# EAGLE design AUVfirstdraft4 (EAGLE 9.1.2)
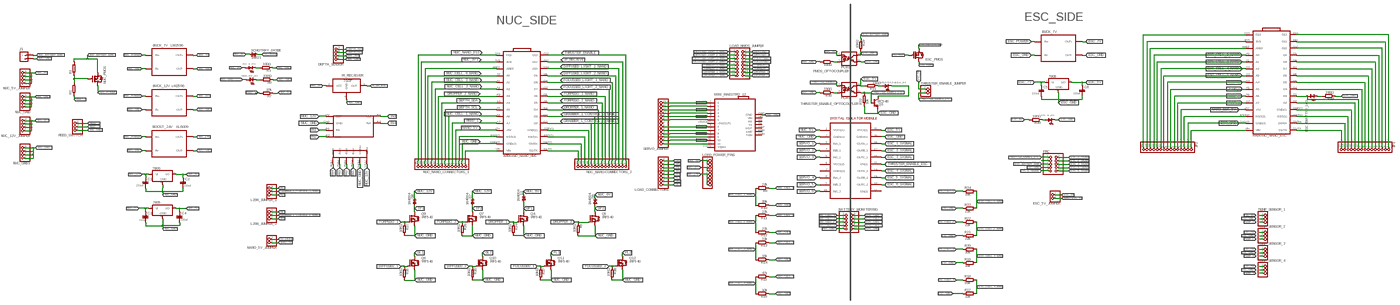
[diagram p0: schematic, sheet 1, overview]
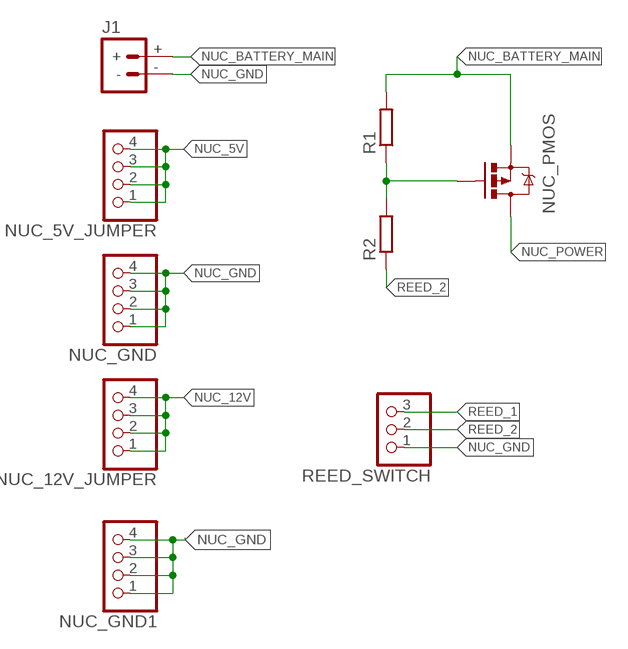
[diagram p1: schematic, sheet 1, part 1 of 4]
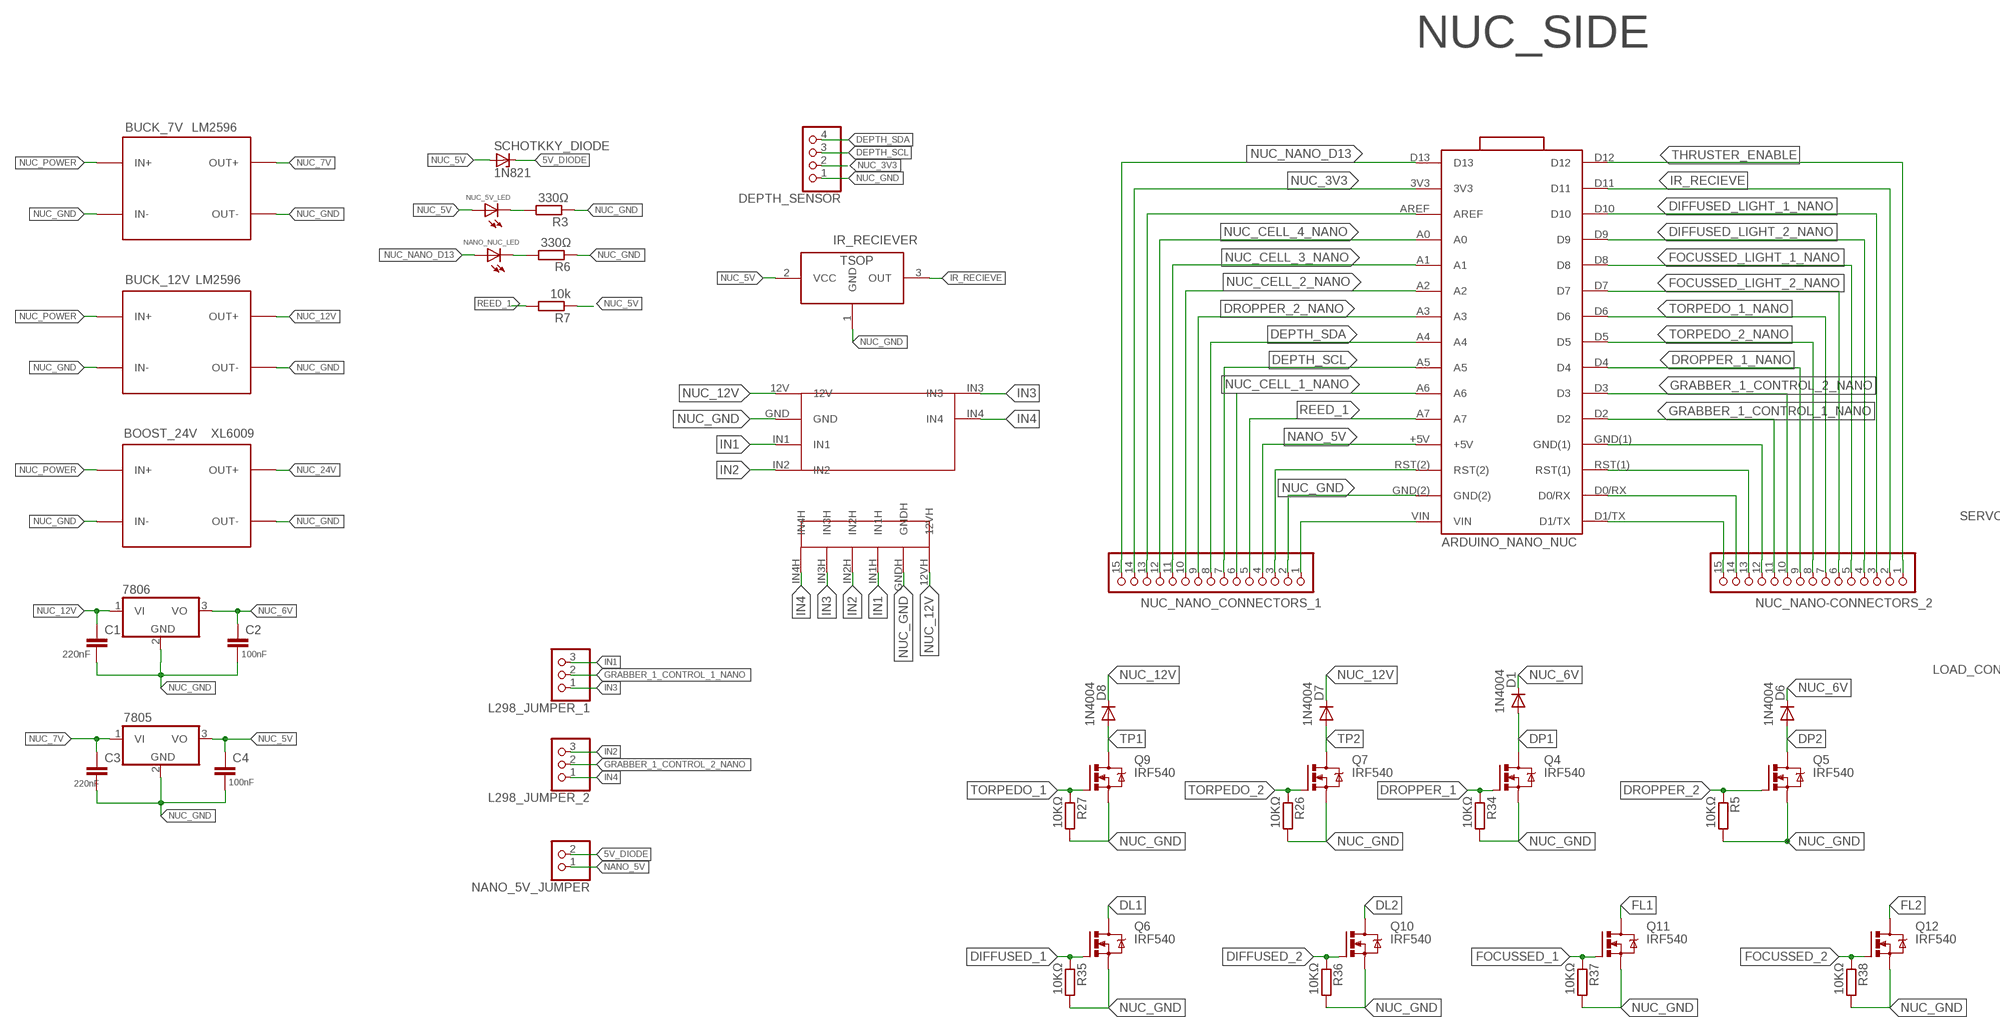
[diagram p2: schematic, sheet 1, part 2 of 4]
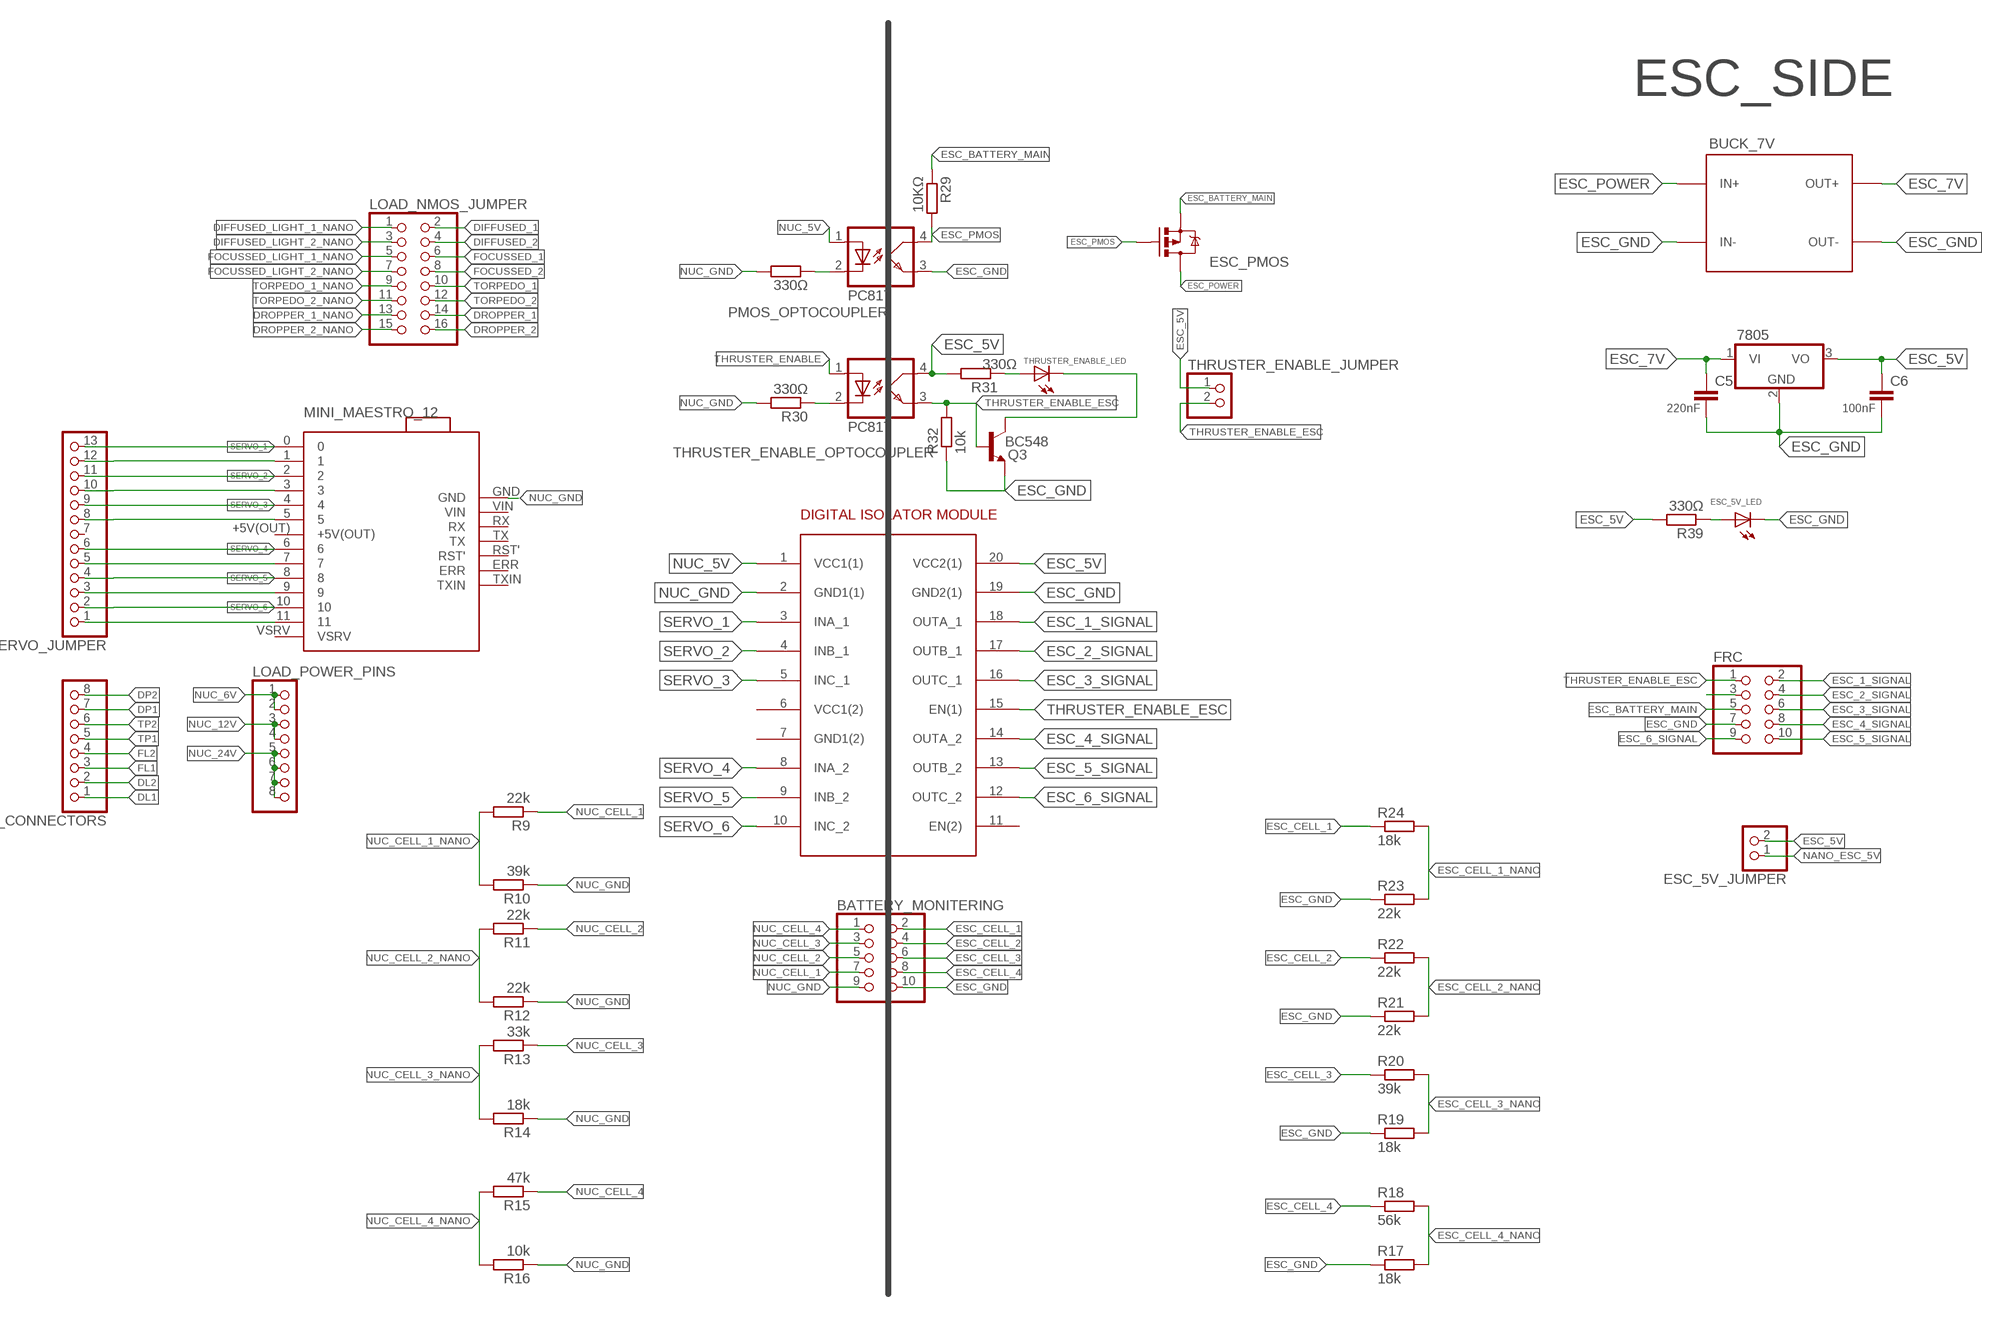
[diagram p3: schematic, sheet 1, part 3 of 4]
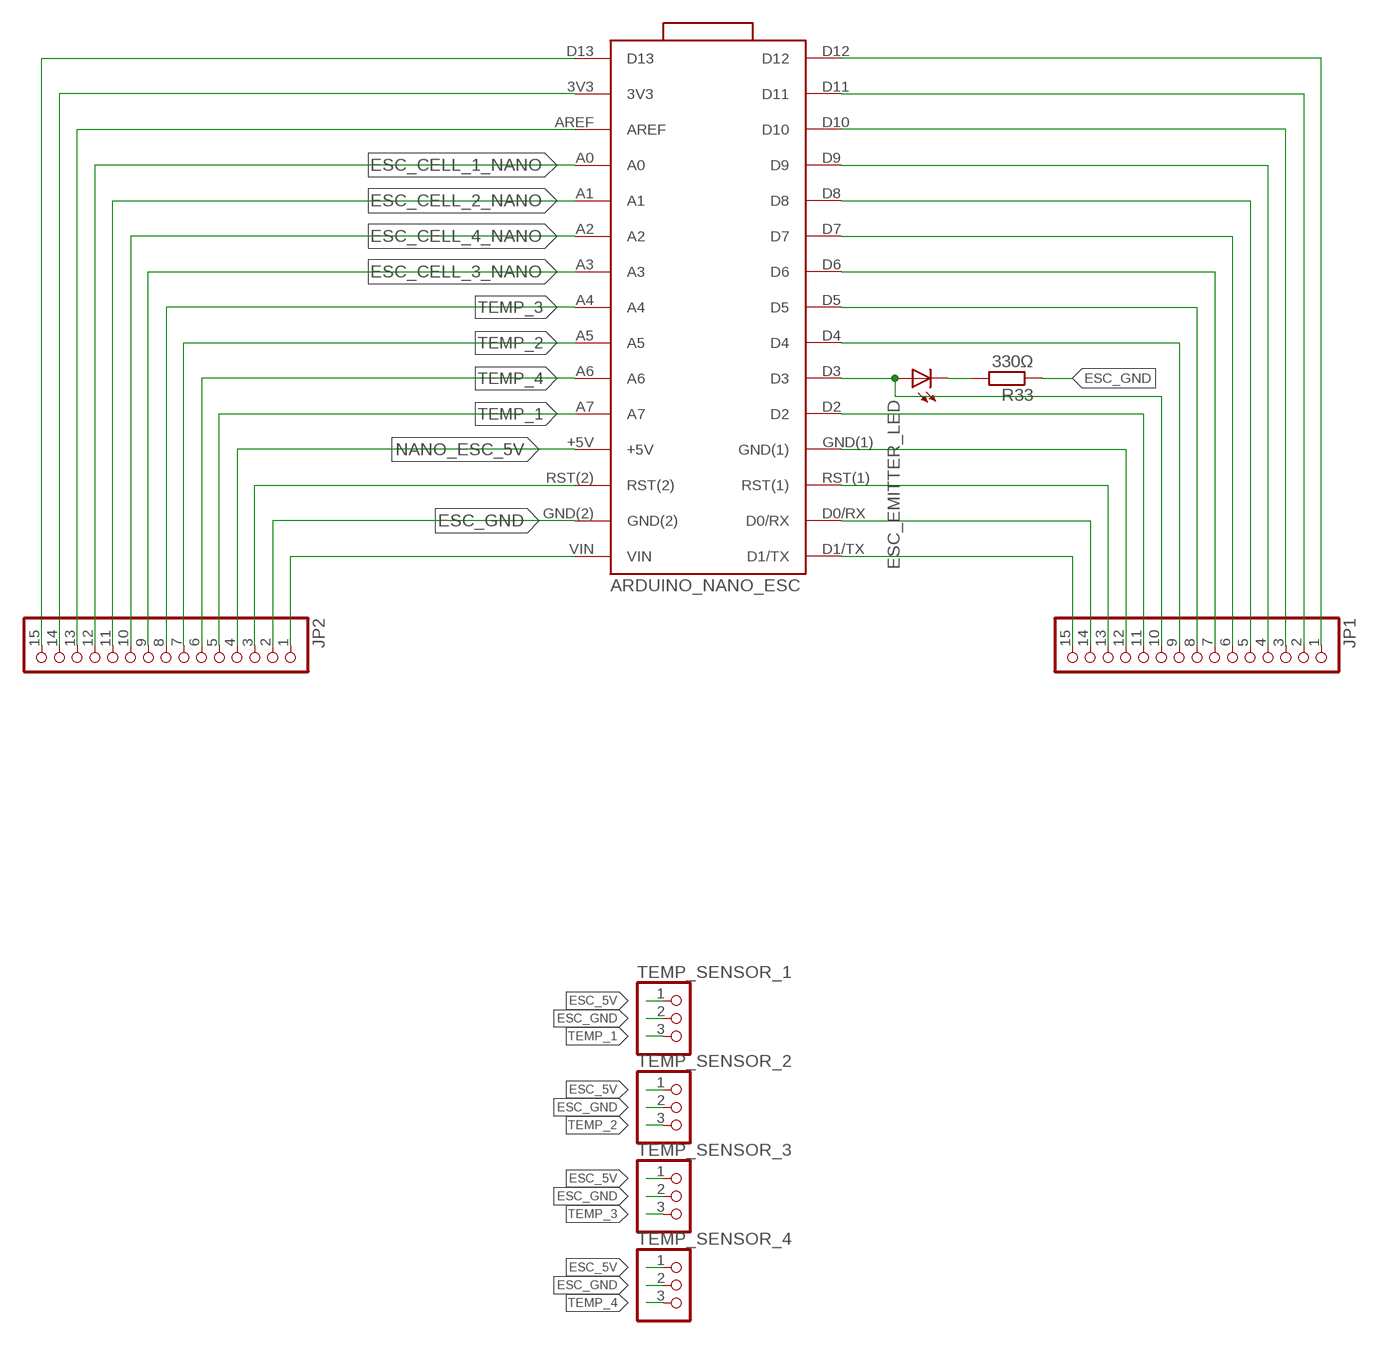
[diagram p4: schematic, sheet 1, part 4 of 4]

## Parts
330Ω  R-EU_0204/7  [0204/7]
7805_ESC  7805TV  [TO220V]
7805_NUC  7805TV  [TO220V]
7806_NUC  7805TV  [TO220V]
BATTERY_MONITERING  PINHD-2X5  [2X05]
BOOST_24V_NUC  DC-DC-STEP-DOWN-LM2596  [DC-DC-STEP-DOWN-LM2596]
BUCK_7V_ESC  DC-DC-STEP-DOWN-LM2596  [DC-DC-STEP-DOWN-LM2596]
BUCK_7V_NUC  DC-DC-STEP-DOWN-LM2596  [DC-DC-STEP-DOWN-LM2596]
BUCK_12_NUC  DC-DC-STEP-DOWN-LM2596  [DC-DC-STEP-DOWN-LM2596]
C1  220nF  C-EU025-024X044  [C025-024X044]
C2  100nF  C-EU025-024X044  [C025-024X044]
C3  220nF  C-EU025-024X044  [C025-024X044]
C4  100nF  C-EU025-024X044  [C025-024X044]
C5  220nF  C-EU025-024X044  [C025-024X044]
C6  100nF  C-EU025-024X044  [C025-024X044]
D1  1N4004  [DO41-10]
D6  1N4004  [DO41-10]
D7  1N4004  [DO41-10]
D8  1N4004  [DO41-10]
DEPTH_SENSOR  PINHD-1X4  [1X04]
ESC_5V_JUMPER  PINHD-1X2  [1X02]
ESC_5V_LED  LED3MM  [LED3MM]
ESC_EMITTER_LED  LED5MM  [LED5MM]
ESC_PMOS  MOSFET-PCHANNELFQP27P06  [TO220V]
FRC  PINHD-2X5  [2X05]
IR_RECIEVER  TSOP34X  [TSOP3XXX]
ISOLATION_CIRCUIT  DIGITAL_ISOLATOR  [DIGITAL_ISOLATOR_MODULE]
J1  BATTERY_CONN_DEANS  [DEANS]
JP1  PINHD-1X15  [1X15]
JP2  PINHD-1X15  [1X15]
L298_JUMPER_1  PINHD-1X3  [1X03]
L298_JUMPER_2  PINHD-1X3  [1X03]
L298_MOTOR_DRIVER  L298MODULE  [L298MODULE]
LOAD_CONNECTORS  PINHD-1X8  [1X08]
LOAD_NMOS_JUMPER  PINHD-2X8  [2X08]
LOAD_POWER_PINS  PINHD-1X8  [1X08]
NANO_5V_JUMPER  PINHD-1X2  [1X02]
NANO_NUC_LED  LED3MM  [LED3MM]
NUC_5V_JUMPER  PINHD-1X4  [1X04]
NUC_5V_LED  LED3MM  [LED3MM]
NUC_12V_JUMPER  PINHD-1X4  [1X04]
NUC_GND  PINHD-1X4  [1X04]
NUC_GND1  PINHD-1X4  [1X04]
NUC_NANO-CONNECTORS_2  PINHD-1X15  [1X15]
NUC_NANO_CONNECTORS_1  PINHD-1X15  [1X15]
NUC_PMOS  MOSFET-PCHANNELFQP27P06  [TO220V]
PMOS_OPTOCOUPLER  PC817  [DIL04]
Q3  BC548  [TO92-EBC]
Q4  IRF540  [TO220BV]
Q5  IRF540  [TO220BV]
Q6  IRF540  [TO220BV]
Q7  IRF540  [TO220BV]
Q9  IRF540  [TO220BV]
Q10  IRF540  [TO220BV]
Q11  IRF540  [TO220BV]
Q12  IRF540  [TO220BV]
R1  R-EU_0204/7  [0204/7]
R2  R-EU_0204/7  [0204/7]
R3  330Ω  R-EU_0204/7  [0204/7]
R5  10KΩ  R-EU_0204/7  [0204/7]
R6  330Ω  R-EU_0204/7  [0204/7]
R7  10k  R-EU_0204/7  [0204/7]
R9  22k  R-EU_0204/7  [0204/7]
R10  39k  R-EU_0204/7  [0204/7]
R11  22k  R-EU_0204/7  [0204/7]
R12  22k  R-EU_0204/7  [0204/7]
R13  33k  R-EU_0204/7  [0204/7]
R14  18k  R-EU_0204/7  [0204/7]
R15  47k  R-EU_0204/7  [0204/7]
R16  10k  R-EU_0204/7  [0204/7]
R17  18k  R-EU_0204/7  [0204/7]
R18  56k  R-EU_0204/7  [0204/7]
R19  18k  R-EU_0204/7  [0204/7]
R20  39k  R-EU_0204/7  [0204/7]
R21  22k  R-EU_0204/7  [0204/7]
R22  22k  R-EU_0204/7  [0204/7]
R23  22k  R-EU_0204/7  [0204/7]
R24  18k  R-EU_0204/7  [0204/7]
R26  10KΩ  R-EU_0204/7  [0204/7]
R27  10KΩ  R-EU_0204/7  [0204/7]
R29  10KΩ  R-EU_0204/7  [0204/7]
R30  330Ω  R-EU_0204/7  [0204/7]
R31  330Ω  R-EU_0204/7  [0204/7]
R32  10k  R-EU_0204/7  [0204/7]
R33  330Ω  R-EU_0204/7  [0204/7]
R34  10KΩ  R-EU_0204/7  [0204/7]
R35  10KΩ  R-EU_0204/7  [0204/7]
R36  10KΩ  R-EU_0204/7  [0204/7]
R37  10KΩ  R-EU_0204/7  [0204/7]
R38  10KΩ  R-EU_0204/7  [0204/7]
R39  330Ω  R-EU_0204/7  [0204/7]
REED_SWITCH  PINHD-1X3  [1X03]
SCHOTKKY_DIODE  1N821  [DO35Z10]
SERVO_JUMPER  PINHD-1X13  [1X13]
TEMP_SENSOR_1  PINHD-1X3  [1X03]
TEMP_SENSOR_2  PINHD-1X3  [1X03]
TEMP_SENSOR_3  PINHD-1X3  [1X03]
TEMP_SENSOR_4  PINHD-1X3  [1X03]
THRUSTER_ENABLE_JUMPER  PINHD-1X2  [1X02]
THRUSTER_ENABLE_LED  LED3MM  [LED3MM]
THRUSTER_ENABLE_OPTOCOUPLER  PC817  [DIL04]
U$1  ARDUINO(NANO_3.0)  [ARDUINO_NANO_30PIN]
U$4  SERVO_CONTROLLER  [SERVO_CONTROLLER]
U$6  ARDUINO(NANO_3.0)  [ARDUINO_NANO_30PIN]

## Nets
5V_DIODE: NANO_5V_JUMPER.2 SCHOTKKY_DIODE.C
DEPTH_SCL: DEPTH_SENSOR.3 NUC_NANO_CONNECTORS_1.7 U$1.A5
DEPTH_SDA: DEPTH_SENSOR.4 NUC_NANO_CONNECTORS_1.8 U$1.A4
DIFFUSED_1: LOAD_NMOS_JUMPER.2 Q6.G R35.1
DIFFUSED_2: LOAD_NMOS_JUMPER.4 Q10.G R36.1
DIFFUSED_LIGHT_1_NANO: LOAD_NMOS_JUMPER.1 NUC_NANO-CONNECTORS_2.3 U$1.D10
DIFFUSED_LIGHT_2_NANO: LOAD_NMOS_JUMPER.3 NUC_NANO-CONNECTORS_2.4 U$1.D9
DL1: LOAD_CONNECTORS.1 Q6.D
DL2: LOAD_CONNECTORS.2 Q10.D
DP1: D1.A LOAD_CONNECTORS.7 Q4.D
DP2: D6.A LOAD_CONNECTORS.8 Q5.D
DROPPER_1: LOAD_NMOS_JUMPER.14 Q4.G R34.1
DROPPER_1_NANO: LOAD_NMOS_JUMPER.13 NUC_NANO-CONNECTORS_2.9 U$1.D4
DROPPER_2: LOAD_NMOS_JUMPER.16 Q5.G R5.1
DROPPER_2_NANO: LOAD_NMOS_JUMPER.15 NUC_NANO_CONNECTORS_1.9 U$1.A3
ESC_1_SIGNAL: FRC.2 ISOLATION_CIRCUIT.18(OUTA_1)
ESC_2_SIGNAL: FRC.4 ISOLATION_CIRCUIT.17(OUTB_1)
ESC_3_SIGNAL: FRC.6 ISOLATION_CIRCUIT.16(OUTC_1)
ESC_4_SIGNAL: FRC.8 ISOLATION_CIRCUIT.14(OUTA_2)
ESC_5_SIGNAL: FRC.10 ISOLATION_CIRCUIT.13(OUTB_2)
ESC_5V: 7805_ESC.3(VO) C6.1 ESC_5V_JUMPER.2 ISOLATION_CIRCUIT.20(VCC2(1)) R31.2 R39.2 TEMP_SENSOR_1.1 TEMP_SENSOR_2.1 TEMP_SENSOR_3.1 TEMP_SENSOR_4.1 THRUSTER_ENABLE_JUMPER.1 THRUSTER_ENABLE_OPTOCOUPLER.4(COL)
ESC_6_SIGNAL: FRC.9 ISOLATION_CIRCUIT.12(OUTC_2)
ESC_7V: 7805_ESC.1(VI) BUCK_7V_ESC.OUT+ C5.1
ESC_BATTERY_MAIN: ESC_PMOS.3(S) FRC.5 R29.1
ESC_CELL_1: BATTERY_MONITERING.2 R24.1
ESC_CELL_1_NANO: JP2.12 R23.2 R24.2 U$6.A0
ESC_CELL_2: BATTERY_MONITERING.4 R22.1
ESC_CELL_2_NANO: JP2.11 R21.2 R22.2 U$6.A1
ESC_CELL_3: BATTERY_MONITERING.6 R20.1
ESC_CELL_3_NANO: JP2.9 R19.2 R20.2 U$6.A3
ESC_CELL_4: BATTERY_MONITERING.8 R18.1
ESC_CELL_4_NANO: JP2.10 R17.2 R18.2 U$6.A2
ESC_GND: 7805_ESC.2(GND) BATTERY_MONITERING.10 BUCK_7V_ESC.IN- BUCK_7V_ESC.OUT- C5.2 C6.2 ESC_5V_LED.K(C) FRC.7 ISOLATION_CIRCUIT.19(GND2(1)) JP2.2 PMOS_OPTOCOUPLER.3(EMIT) Q3.E R17.1 R19.1 R21.1 R23.1 R32.1 R33.1 TEMP_SENSOR_1.2 TEMP_SENSOR_2.2 TEMP_SENSOR_3.2 TEMP_SENSOR_4.2 U$6.GND(2)
ESC_PMOS: ESC_PMOS.1(G) PMOS_OPTOCOUPLER.4(COL) R29.2
ESC_POWER: BUCK_7V_ESC.IN+ ESC_PMOS.2(D)
FL1: LOAD_CONNECTORS.3 Q11.D
FL2: LOAD_CONNECTORS.4 Q12.D
FOCUSSED_1: LOAD_NMOS_JUMPER.6 Q11.G R37.1
FOCUSSED_2: LOAD_NMOS_JUMPER.8 Q12.G R38.1
FOCUSSED_LIGHT_1_NANO: LOAD_NMOS_JUMPER.5 NUC_NANO-CONNECTORS_2.5 U$1.D8
FOCUSSED_LIGHT_2_NANO: LOAD_NMOS_JUMPER.7 NUC_NANO-CONNECTORS_2.6 U$1.D7
GRABBER_1_CONTROL_1_NANO: L298_JUMPER_1.2 NUC_NANO-CONNECTORS_2.11 U$1.D2
GRABBER_1_CONTROL_2_NANO: L298_JUMPER_2.2 NUC_NANO-CONNECTORS_2.10 U$1.D3
IN1: L298_JUMPER_1.3 L298_MOTOR_DRIVER.IN1 L298_MOTOR_DRIVER.IN1H
IN2: L298_JUMPER_2.3 L298_MOTOR_DRIVER.IN2 L298_MOTOR_DRIVER.IN2H
IN3: L298_JUMPER_1.1 L298_MOTOR_DRIVER.IN3 L298_MOTOR_DRIVER.IN3H
IN4: L298_JUMPER_2.1 L298_MOTOR_DRIVER.IN4 L298_MOTOR_DRIVER.IN4H
IR_RECIEVE: IR_RECIEVER.3(OUT) NUC_NANO-CONNECTORS_2.2 U$1.D11
N$1: NUC_NANO_CONNECTORS_1.1 U$1.VIN
N$2: NANO_NUC_LED.K(C) R6.2
N$4: R31.1 THRUSTER_ENABLE_LED.A
N$5: ESC_5V_LED.A R39.1
N$6: SERVO_JUMPER.12 U$4.1
N$7: NUC_NANO_CONNECTORS_1.3 U$1.RST(2)
N$8: 330Ω.1 PMOS_OPTOCOUPLER.2(C)
N$9: SERVO_JUMPER.10 U$4.3
N$10: ESC_EMITTER_LED.A JP1.10 U$6.D3
N$11: SERVO_JUMPER.8 U$4.5
N$12: FRC.3
N$13: SERVO_JUMPER.5 U$4.7
N$14: R30.1 THRUSTER_ENABLE_OPTOCOUPLER.2(C)
N$15: SERVO_JUMPER.3 U$4.9
N$16: Q3.C THRUSTER_ENABLE_LED.K(C)
N$17: NUC_NANO_CONNECTORS_1.13 U$1.AREF
N$18: ESC_EMITTER_LED.K(C) R33.2
N$19: SERVO_JUMPER.1 U$4.11
N$20: NUC_NANO-CONNECTORS_2.15 U$1.D1/TX
N$21: NUC_NANO-CONNECTORS_2.14 U$1.D0/RX
N$22: NUC_NANO-CONNECTORS_2.13 U$1.RST(1)
N$23: NUC_NANO-CONNECTORS_2.12 U$1.GND(1)
N$30: JP2.1 U$6.VIN
N$31: JP2.3 U$6.RST(2)
N$32: JP2.13 U$6.AREF
N$33: JP2.14 U$6.3V3
N$34: NUC_PMOS.1(G) R1.1 R2.2
N$35: JP2.15 U$6.D13
N$36: JP1.15 U$6.D1/TX
N$37: JP1.14 U$6.D0/RX
N$38: NUC_5V_LED.K(C) R3.2
N$39: JP1.13 U$6.RST(1)
N$40: JP1.12 U$6.GND(1)
N$41: JP1.11 U$6.D2
N$42: JP1.9 U$6.D4
N$43: JP1.8 U$6.D5
N$44: JP1.7 U$6.D6
N$45: JP1.6 U$6.D7
N$46: JP1.5 U$6.D8
N$47: JP1.4 U$6.D9
N$48: JP1.3 U$6.D10
N$49: JP1.2 U$6.D11
N$50: JP1.1 U$6.D12
NANO_5V: NANO_5V_JUMPER.1 NUC_NANO_CONNECTORS_1.4 U$1.+5V
NANO_ESC_5V: ESC_5V_JUMPER.1 JP2.4 U$6.+5V
NUC_3V3: DEPTH_SENSOR.2 NUC_NANO_CONNECTORS_1.14 U$1.3V3
NUC_5V: 7805_NUC.3(VO) C4.1 IR_RECIEVER.2(VCC) ISOLATION_CIRCUIT.1(VCC1(1)) NUC_5V_JUMPER.1 NUC_5V_JUMPER.2 NUC_5V_JUMPER.3 NUC_5V_JUMPER.4 NUC_5V_LED.A PMOS_OPTOCOUPLER.1(A) R7.1 SCHOTKKY_DIODE.A
NUC_6V: 7806_NUC.3(VO) C2.1 D1.C D6.C LOAD_POWER_PINS.1 LOAD_POWER_PINS.2
NUC_7V: 7805_NUC.1(VI) BUCK_7V_NUC.OUT+ C3.1
NUC_12V: 7806_NUC.1(VI) BUCK_12_NUC.OUT+ C1.1 D7.C D8.C L298_MOTOR_DRIVER.12V L298_MOTOR_DRIVER.12VH LOAD_POWER_PINS.3 LOAD_POWER_PINS.4 NUC_12V_JUMPER.1 NUC_12V_JUMPER.2 NUC_12V_JUMPER.3 NUC_12V_JUMPER.4
NUC_24V: BOOST_24V_NUC.OUT+ LOAD_POWER_PINS.5 LOAD_POWER_PINS.6 LOAD_POWER_PINS.7 LOAD_POWER_PINS.8
NUC_BATTERY_MAIN: J1.+ NUC_PMOS.3(S) R1.2
NUC_CELL_1: BATTERY_MONITERING.7 R9.1
NUC_CELL_1_NANO: NUC_NANO_CONNECTORS_1.6 R9.2 R10.2 U$1.A6
NUC_CELL_2: BATTERY_MONITERING.5 R11.1
NUC_CELL_2_NANO: NUC_NANO_CONNECTORS_1.10 R11.2 R12.2 U$1.A2
NUC_CELL_3: BATTERY_MONITERING.3 R13.1
NUC_CELL_3_NANO: NUC_NANO_CONNECTORS_1.11 R13.2 R14.2 U$1.A1
NUC_CELL_4: BATTERY_MONITERING.1 R15.1
NUC_CELL_4_NANO: NUC_NANO_CONNECTORS_1.12 R15.2 R16.2 U$1.A0
NUC_GND: 330Ω.2 7805_NUC.2(GND) 7806_NUC.2(GND) BATTERY_MONITERING.9 BOOST_24V_NUC.IN- BOOST_24V_NUC.OUT- BUCK_7V_NUC.IN- BUCK_7V_NUC.OUT- BUCK_12_NUC.IN- BUCK_12_NUC.OUT- C1.2 C2.2 C3.2 C4.2 DEPTH_SENSOR.1 IR_RECIEVER.1(GND) ISOLATION_CIRCUIT.2(GND1(1)) J1.- L298_MOTOR_DRIVER.GND L298_MOTOR_DRIVER.GNDH NUC_GND1.1 NUC_GND1.2 NUC_GND1.3 NUC_GND1.4 NUC_GND.1 NUC_GND.2 NUC_GND.3 NUC_GND.4 NUC_NANO_CONNECTORS_1.2 Q4.S Q5.S Q6.S Q7.S Q9.S Q10.S Q11.S Q12.S R3.1 R5.2 R6.1 R10.1 R12.1 R14.1 R16.1 R26.2 R27.2 R30.2 R34.2 R35.2 R36.2 R37.2 R38.2 REED_SWITCH.1 U$1.GND(2) U$4.GND
NUC_NANO_D13: NANO_NUC_LED.A NUC_NANO_CONNECTORS_1.15 U$1.D13
NUC_POWER: BOOST_24V_NUC.IN+ BUCK_7V_NUC.IN+ BUCK_12_NUC.IN+ NUC_PMOS.2(D)
REED_1: NUC_NANO_CONNECTORS_1.5 R7.2 REED_SWITCH.3 U$1.A7
REED_2: R2.1 REED_SWITCH.2
SERVO_1: ISOLATION_CIRCUIT.3(INA_1) SERVO_JUMPER.13 U$4.0
SERVO_2: ISOLATION_CIRCUIT.4(INB_1) SERVO_JUMPER.11 U$4.2
SERVO_3: ISOLATION_CIRCUIT.5(INC_1) SERVO_JUMPER.9 U$4.4
SERVO_4: ISOLATION_CIRCUIT.8(INA_2) SERVO_JUMPER.6 U$4.6
SERVO_5: ISOLATION_CIRCUIT.9(INB_2) SERVO_JUMPER.4 U$4.8
SERVO_6: ISOLATION_CIRCUIT.10(INC_2) SERVO_JUMPER.2 U$4.10
TEMP_1: JP2.5 TEMP_SENSOR_1.3 U$6.A7
TEMP_2: JP2.7 TEMP_SENSOR_2.3 U$6.A5
TEMP_3: JP2.8 TEMP_SENSOR_3.3 U$6.A4
TEMP_4: JP2.6 TEMP_SENSOR_4.3 U$6.A6
THRUSTER_ENABLE: NUC_NANO-CONNECTORS_2.1 THRUSTER_ENABLE_OPTOCOUPLER.1(A) U$1.D12
THRUSTER_ENABLE_ESC: FRC.1 ISOLATION_CIRCUIT.15(EN(1)) Q3.B R32.2 THRUSTER_ENABLE_JUMPER.2 THRUSTER_ENABLE_OPTOCOUPLER.3(EMIT)
TORPEDO_1: LOAD_NMOS_JUMPER.10 Q9.G R27.1
TORPEDO_1_NANO: LOAD_NMOS_JUMPER.9 NUC_NANO-CONNECTORS_2.7 U$1.D6
TORPEDO_2: LOAD_NMOS_JUMPER.12 Q7.G R26.1
TORPEDO_2_NANO: LOAD_NMOS_JUMPER.11 NUC_NANO-CONNECTORS_2.8 U$1.D5
TP1: D8.A LOAD_CONNECTORS.5 Q9.D
TP2: D7.A LOAD_CONNECTORS.6 Q7.D
Unconnected: ISOLATION_CIRCUIT.6(VCC1(2)) ISOLATION_CIRCUIT.7(GND1(2)) ISOLATION_CIRCUIT.11(EN(2)) SERVO_JUMPER.7 U$4.+5V(OUT) U$4.ERR U$4.RST' U$4.RX U$4.TX U$4.TXIN U$4.VIN U$4.VSRV

## Notes on the sheet
- NUC_SIDE | ESC_SIDE
- BUCK_7V
- BUCK_7V | LM2596
- 7805
- BUCK_12V | LM2596
- MINI_MAESTRO_12
- BOOST_24V | XL6009
- ARDUINO_NANO_ESC
- ARDUINO_NANO_NUC
- 7806
- 7805

## Library data of the parts
330Ω R1-R3 R5-R7 R9-R24 R26 R27 R29-R39 = resistor:R-EU_: RESISTOR, European symbol
7805_ESC 7805_NUC 7806_NUC = linear:78*: Positive VOLTAGE REGULATOR Source: http://cache.national.com/ds/LM/LM78L05.pdf http://www.fairchildsemi.com/ds/LM/LM7805.pdf
BATTERY_MONITERING FRC = pinhead:PINHD-2X5: PIN HEADER
BOOST_24V_NUC BUCK_7V_ESC BUCK_7V_NUC BUCK_12_NUC = diy-modules:DC-DC-STEP-DOWN-LM2596: DC/DC Step-Down Regulator based on LM2596-ADJ chip LM2596 datasheet available here: http://www.ti.com/lit/ds/symlink/lm2596.pdf Click here to find device on ebay.com <http://www.ebay.com/sch/lm2596+power+regulator>
C1-C6 = rcl:C-EU: CAPACITOR, European symbol
D1 D6-D8 = adafruit:1N4004: DIODE General purpose 1N400x type rectifier (With bigger pads) http://www.ladyada.net/library/pcb/eaglelibrary.html
DEPTH_SENSOR NUC_5V_JUMPER NUC_12V_JUMPER NUC_GND NUC_GND1 = pinhead:PINHD-1X4: PIN HEADER
ESC_5V_JUMPER NANO_5V_JUMPER THRUSTER_ENABLE_JUMPER = pinhead:PINHD-1X2: PIN HEADER
ESC_5V_LED ESC_EMITTER_LED NANO_NUC_LED NUC_5V_LED THRUSTER_ENABLE_LED = adafruit:LED: LED OSRAM: - CHIPLED LG R971, LG N971, LY N971, LG Q971, LY Q971, LO R971, LY R971 LH N974, LH R974 LS Q976, LO Q976, LY Q976 LO Q996 - Hyper CHIPLED LW Q18S LB Q993, LB Q99A, LB R99A - SideLED LS A670, LO A670, LY A670, LG A670, LP A670 LB A673, LV A673, LT A673, LW A673 LH A674 LY A675 LS A676, LA A676, LO A676, LY A676, LW A676 LS A679, LY A679, LG A679 - Hyper Micro SIDELED® LS Y876, LA Y876, LO Y876, LY Y876 LT Y87S - SmartLED LW L88C, LW L88S LB L89C, LB L89S, LG L890 LS L89K, LO L89K, LY L89K LS L896, LA L896, LO L896, LY L896 - TOPLED LS T670, LO T670, LY T670, LG T670, LP T670 LSG T670, LSP T670, LSY T670, LOP T670, LYG T670 LG T671, LOG T671, LSG T671 LB T673, LV T673, LT T673, LW T673 LH T674 LS T676, LA T676, LO T676, LY T676, LB T676, LH T676, LSB T676, LW T676 LB T67C, LV T67C, LT T67C, LS T67K, LO T67K, LY T67K, LW E67C LS E67B, LA E67B, LO E67B, LY E67B, LB E67C, LV E67C, LT E67C LW T67C LS T679, LY T679, LG T679 LS T770, LO T770, LY T770, LG T770, LP T770 LB T773, LV T773, LT T773, LW T773 LH T774 LS E675, LA E675, LY E675, LS T675 LS T776, LA T776, LO T776, LY T776, LB T776 LHGB T686 LT T68C, LB T68C - Hyper Mini TOPLED® LB M676 - Mini TOPLED Santana® LG M470 LS M47K, LO M47K, LY M47K Source: http://www.osram.convergy.de/
ESC_PMOS NUC_PMOS = SparkFun-DiscreteSemi:MOSFET-PCHANNEL: Generic PMOSFET IRLML2244 - TRANS-11153 (SOT-23 -20V -4.3A) (1.Gate 2.Source 3.Drain) FQP27P06 - COM-10349 <http://www.sparkfun.com/products/10349> (TO-220 -60V -27A) (1.Gate 2.Source 3.Drain)
IR_RECIEVER = CEDT_JANUARY_2015_v5:TSOP34X: Vishay IR Reciever Product Page <http://www.vishay.com/product?docid=82489> Family -TSOP34XX Part by : Rohit Gupta
ISOLATION_CIRCUIT = ISO7330C DIGITAL ISOLATOR MODULE:DIGITAL_ISOLATOR
J1 = SparkFun-Connectors:BATTERY_CONN: Battery Connectors Various footprints for battery connections SparkFun Products: Deans Connector -M/F Pair <https://www.sparkfun.com/products/11864>; SF_ID: PRT-11864
JP1 JP2 NUC_NANO-CONNECTORS_2 NUC_NANO_CONNECTORS_1 = pinhead:PINHD-1X15: PIN HEADER
L298_JUMPER_1 L298_JUMPER_2 REED_SWITCH TEMP_SENSOR_1-TEMP_SENSOR_4 = pinhead:PINHD-1X3: PIN HEADER
L298_MOTOR_DRIVER = l298module:L298MODULE
LOAD_CONNECTORS LOAD_POWER_PINS = pinhead:PINHD-1X8: PIN HEADER
LOAD_NMOS_JUMPER = pinhead:PINHD-2X8: PIN HEADER
PMOS_OPTOCOUPLER THRUSTER_ENABLE_OPTOCOUPLER = optocoupler:PC817: SHARP OPTO COUPLER; MPN: PC817X4J000F; OC_FARNELL: 9707727; OC_NEWARK: 97K7059
Q3 = transistor-npn:BC548*: NPN Transistor
Q4-Q7 Q9-Q12 = transistor-power:IRF540: HEXFET Power MOSFET
SCHOTKKY_DIODE = diode:1N821: Reference DIODE temperature compensated, 6,2 V
SERVO_JUMPER = pinhead:PINHD-1X13: PIN HEADER
U$1 U$6 = Arduino_Nano_3:ARDUINO(NANO_3.0)
U$4 = Servo Controller:SERVO_CONTROLLER

## Board
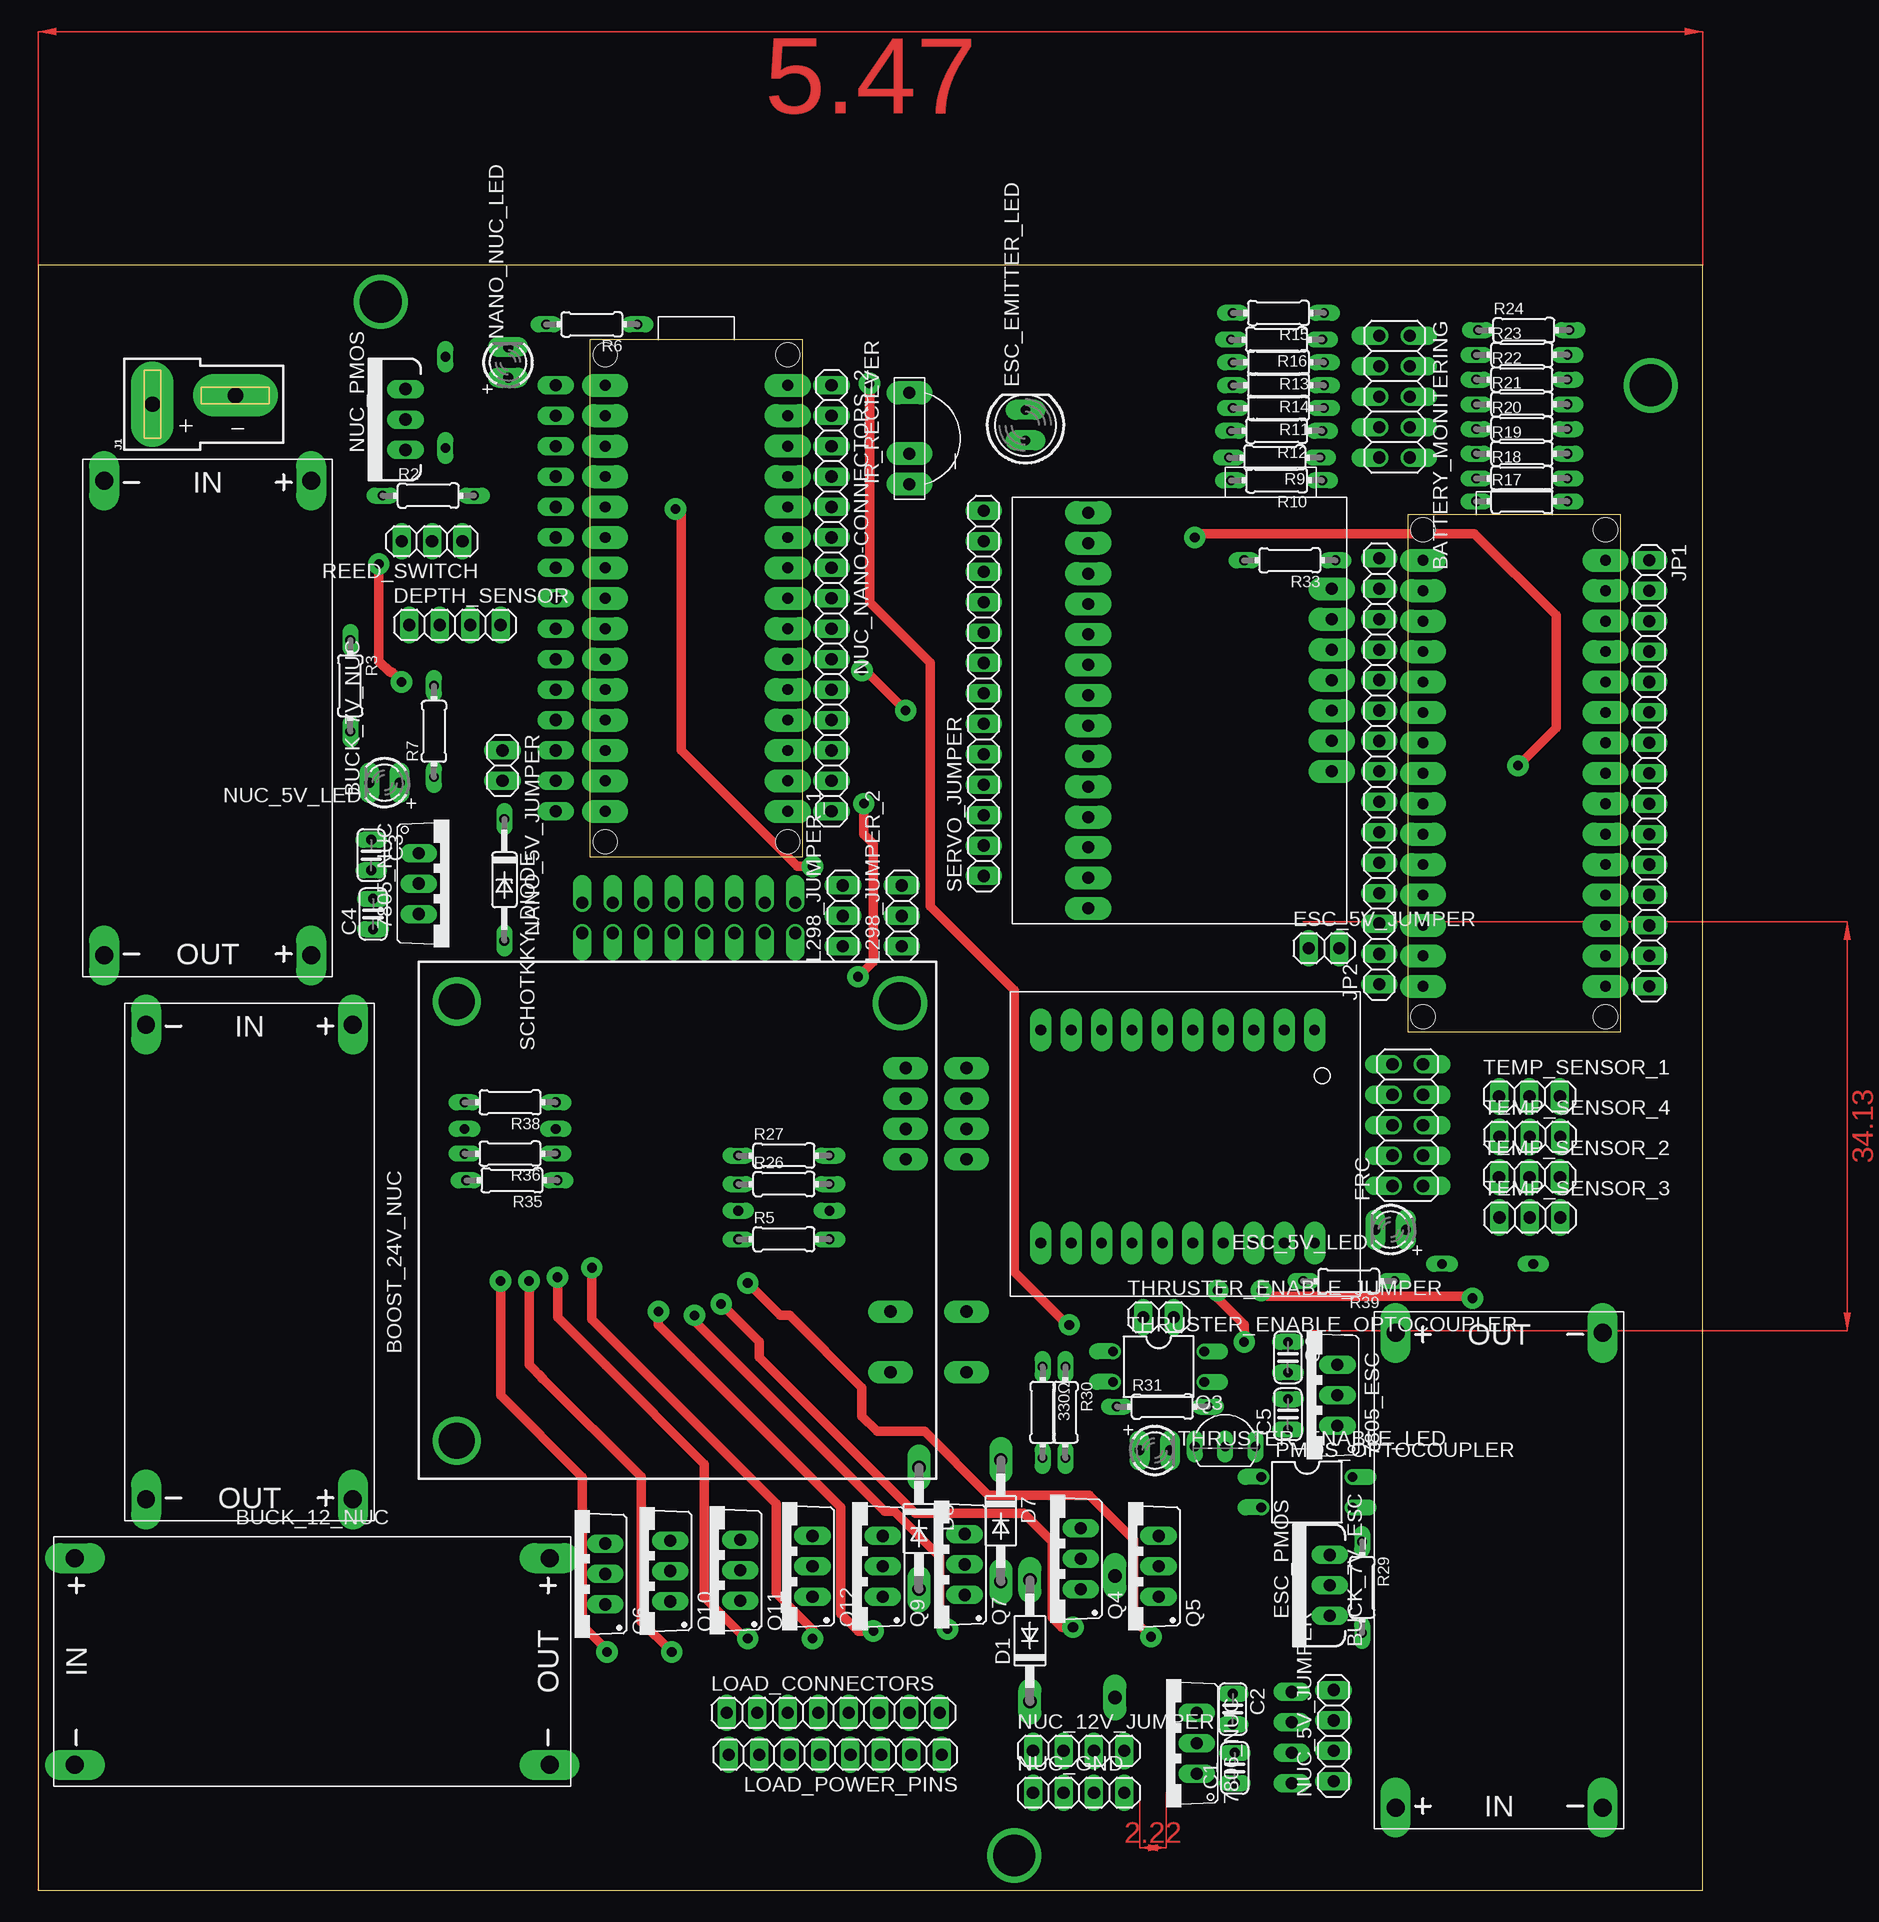
[diagram p5: board, top side]
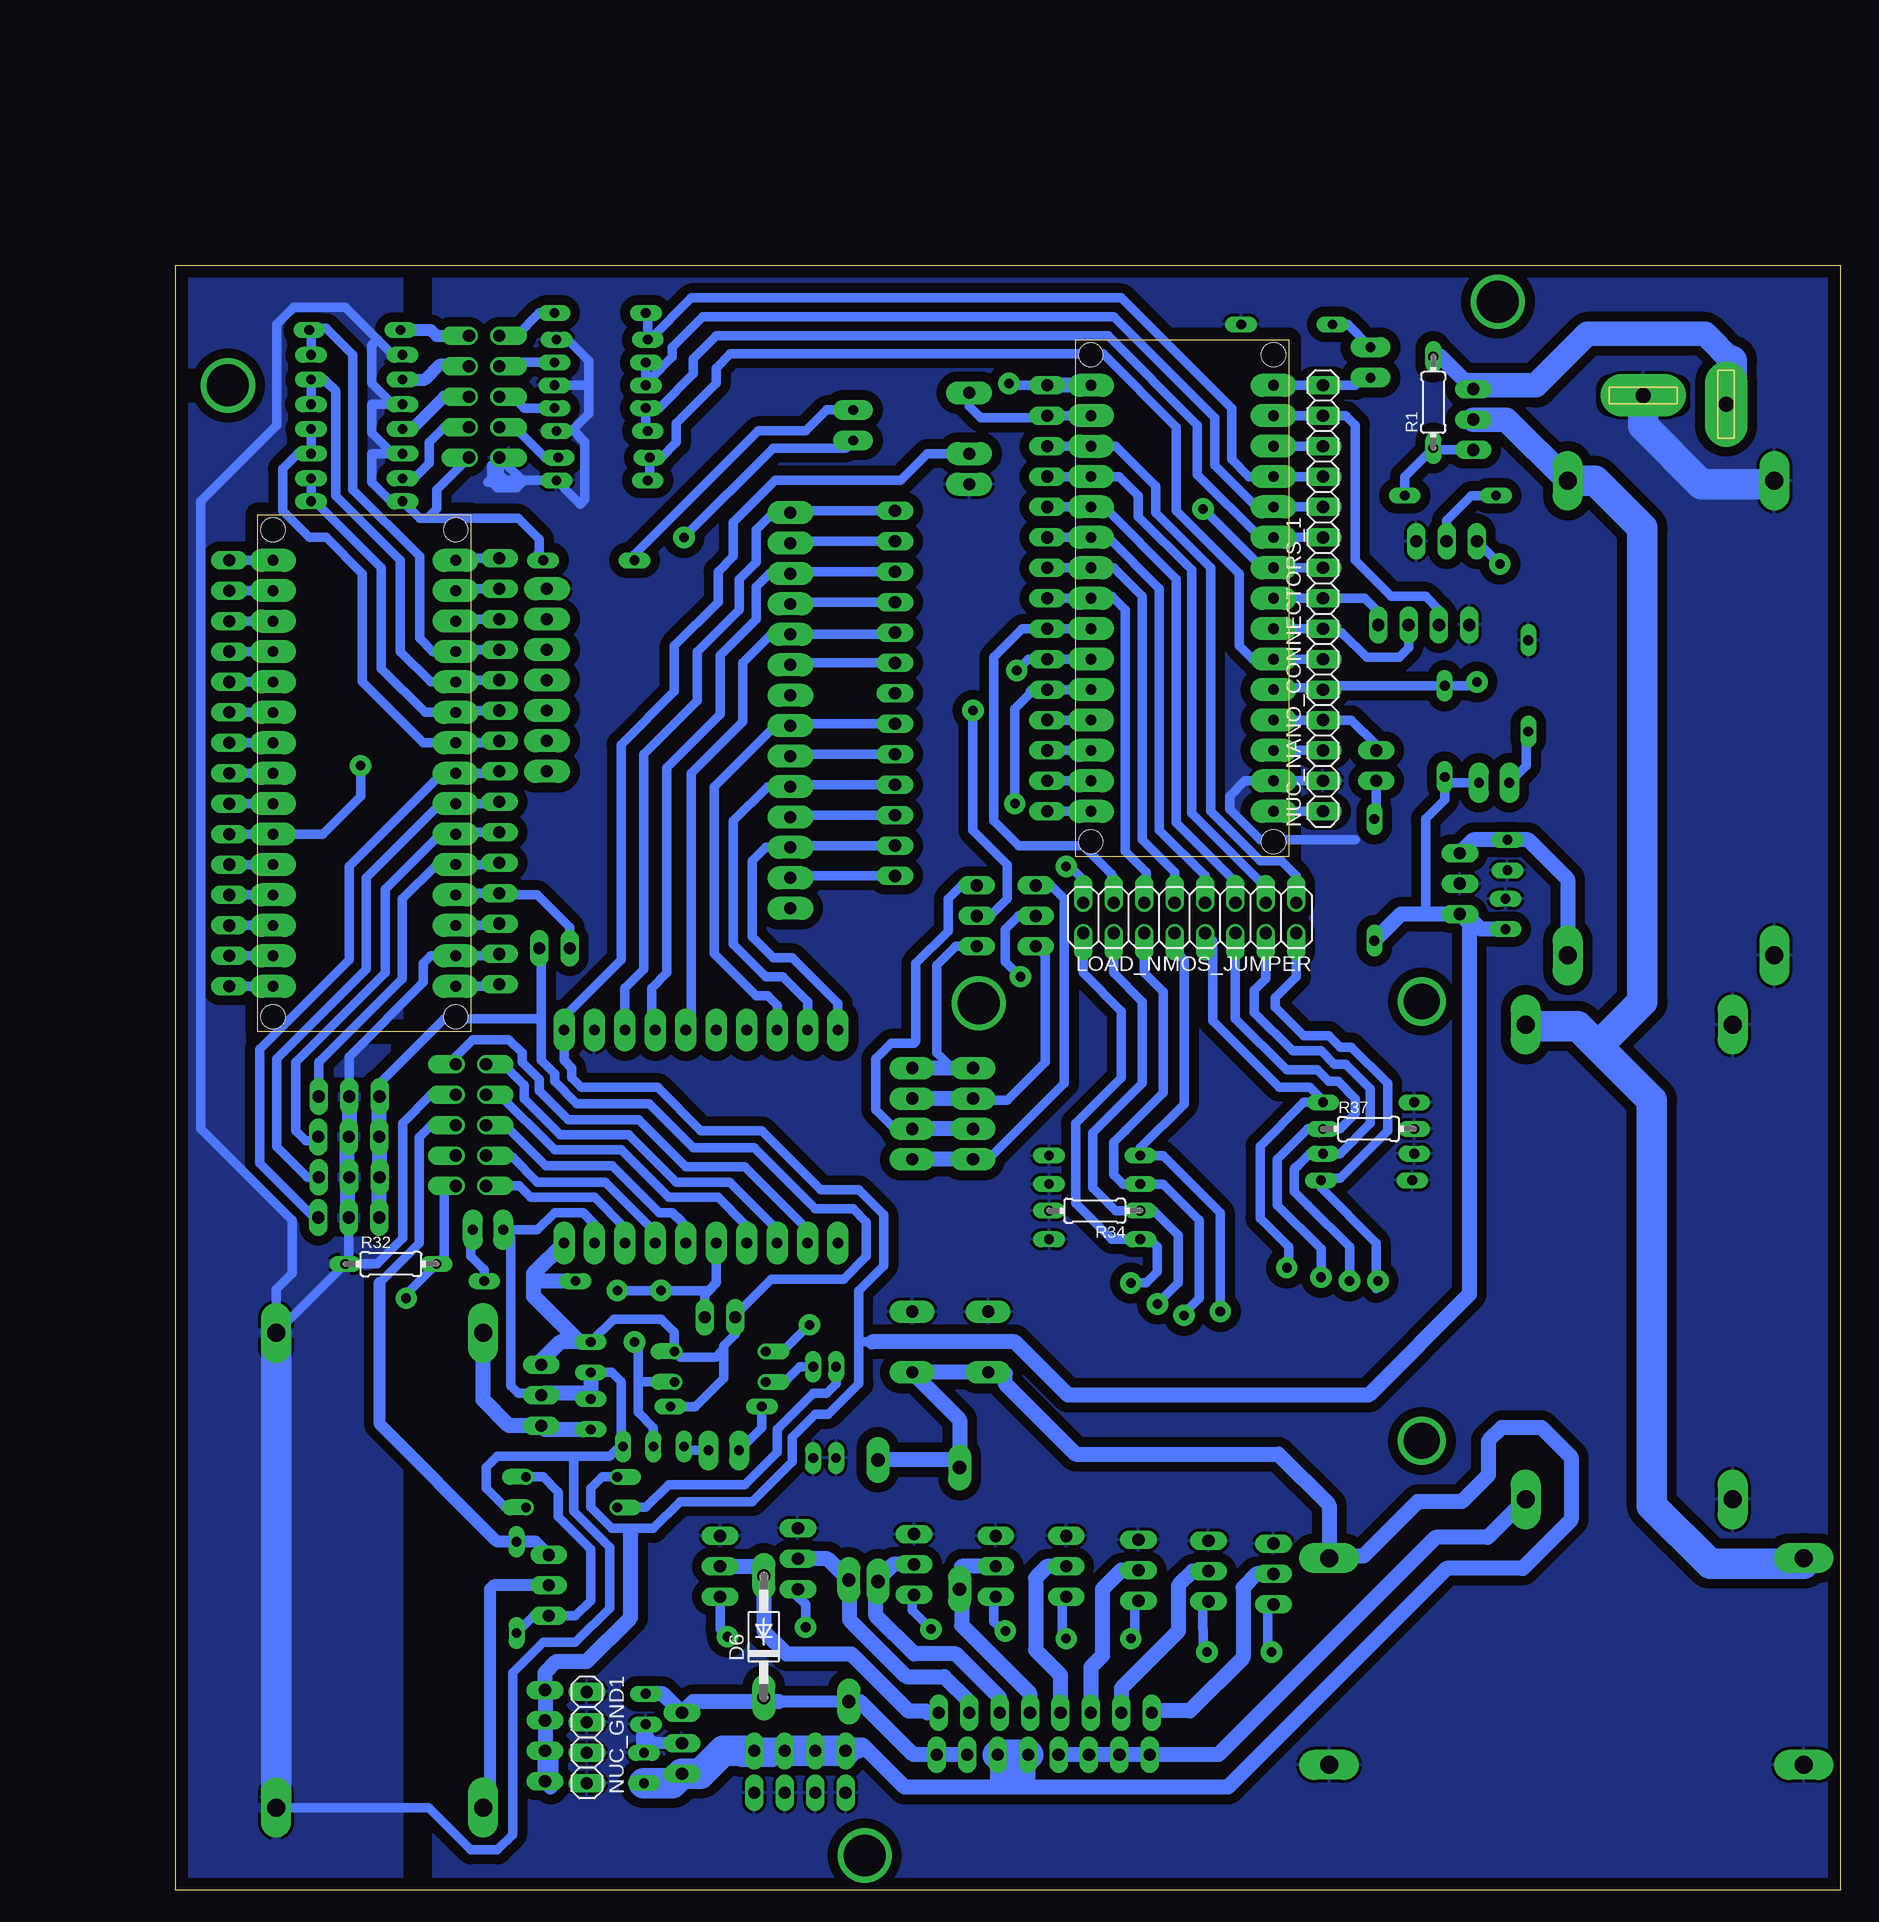
[diagram p6: board, bottom side, seen from below]

Size 138.94 x 135.64 mm. Coordinates in mm from the lower left corner, seen from the top.
Outline: 0,0 138.94,0 138.94,135.64 0,135.64 0,0
Copper layers (1*16): Top 0.035mm / dielectric 1.5mm / Bottom 0.035mm
Design rules "default *": minimum track width 6mil, minimum drill 0.35mm, track to track 12mil, track to pad 12mil, pad to pad 12mil, via to via 12mil, smd to smd 12mil, copper to edge 40mil, drill to drill 6mil, minimum pad ring 10mil, minimum via ring 8mil, stop-mask expansion 4mil, vias tented up to drill 0mil, thermal gap 10mil

### Footprints (pad centres in the part's own frame; a part is rotated, then mirrored left to right if it is on the bottom)
0204/7 = drill 0.813 long: 1 -3.81,0; 2 3.81,0
TO220V = drill 1.016 long: 1 -2.54,-2.54; 2 0,-2.54; 3 2.54,-2.54
2X05 = drill 1.016 offset: 1 -5.08,-1.27; 2 -5.08,1.27; 3 -2.54,-1.27; 4 -2.54,1.27; 5 0,-1.27; 6 0,1.27; 7 2.54,-1.27; 8 2.54,1.27; 9 5.08,-1.27; 10 5.08,1.27
DC-DC-STEP-DOWN-LM2596 = drill 1.5 pad 2.5 long: IN+ -19.812,8.636; IN- -19.812,-8.636; OUT+ 19.812,8.636; OUT- 19.812,-8.636
C025-024X044 = drill 0.813 long: 1 -1.27,0; 2 1.27,0
DO41-10 = drill 1.118 pad 1.93 long: A 5.08,0; C -5.08,0
1X04 = drill 1.016 long: 1 -3.81,0; 2 -1.27,0; 3 1.27,0; 4 3.81,0
1X02 = drill 1.016 long: 1 -1.27,0; 2 1.27,0
LED3MM = drill 0.813 pad 1.676 long: A -1.27,0; K 1.27,0
LED5MM = drill 0.813 pad 1.676 long: A -1.27,0; K 1.27,0
TO220V' = drill 1.016 long: 1 -2.54,0; 2 0,0; 3 2.54,0
TSOP3XXX = drill 1 pad 1.93 long: 1 -2.54,0; 2 0,0; 3 5.08,0
DIGITAL_ISOLATOR_MODULE = drill 0.9 pad 1.778 long: 1 2.54,25.4; 2 2.54,22.86; 3 2.54,20.32; 4 2.54,17.78; 5 2.54,15.24; 6 2.54,12.7; 7 2.54,10.16; 8 2.54,7.62; 9 2.54,5.08; 10 2.54,2.54; 11 20.32,2.54; 12 20.32,5.08; 13 20.32,7.62; 14 20.32,10.16; 15 20.32,12.7; 16 20.32,15.24; 17 20.32,17.78; 18 20.32,20.32; 19 20.32,22.86; 20 20.32,25.4
DEANS = drill 1.27 pad 3.556 long: + 0,0; - 0.737,-6.921
1X15 = drill 1.016 long: 1 -17.78,0; 2 -15.24,0; 3 -12.7,0; 4 -10.16,0; 5 -7.62,0; 6 -5.08,0; 7 -2.54,0; 8 0,0; 9 2.54,0; 10 5.08,0; 11 7.62,0; 12 10.16,0; 13 12.7,0; 14 15.24,0; 15 17.78,0
1X03 = drill 1.016 long: 1 -2.54,0; 2 0,0; 3 2.54,0
L298MODULE = drill 1.016 pad 1.88 long: 12V 8.89,3.81; 12VH 8.89,-2.54; GND 13.97,3.81; GNDH 13.97,-2.54; IN1 26.67,2.54; IN1H 26.67,-2.54; IN2 29.21,2.54; IN2H 29.21,-2.54; IN3 31.75,2.54; IN3H 31.75,-2.54; IN4 34.29,2.54; IN4H 34.29,-2.54
1X08 = drill 1.016 long: 1 -8.89,0; 2 -6.35,0; 3 -3.81,0; 4 -1.27,0; 5 1.27,0; 6 3.81,0; 7 6.35,0; 8 8.89,0
2X08 = drill 1.016 offset: 1 -8.89,-1.27; 2 -8.89,1.27; 3 -6.35,-1.27; 4 -6.35,1.27; 5 -3.81,-1.27; 6 -3.81,1.27; 7 -1.27,-1.27; 8 -1.27,1.27; 9 1.27,-1.27; 10 1.27,1.27; 11 3.81,-1.27; 12 3.81,1.27; 13 6.35,-1.27; 14 6.35,1.27; 15 8.89,-1.27; 16 8.89,1.27
DIL04 = drill 0.813 offset: 1 -1.27,-3.81; 2 1.27,-3.81; 3 1.27,3.81; 4 -1.27,3.81
TO92-EBC = drill 0.813 long: B 0,-1.27; C -2.54,-1.27; E 2.54,-1.27
TO220BV = drill 1.016 long: D 0,-2.54; G -2.54,-2.54; S 2.54,-2.54
DO35Z10 = drill 0.813 long: A 5.08,0; C -5.08,0
1X13 = drill 1.016 long: 1 -15.24,0; 2 -12.7,0; 3 -10.16,0; 4 -7.62,0; 5 -5.08,0; 6 -2.54,0; 7 0,0; 8 2.54,0; 9 5.08,0; 10 7.62,0; 11 10.16,0; 12 12.7,0; 13 15.24,0
ARDUINO_NANO_30PIN = drill 0.9 pad 1.93 long: 3V3 16.51,6.35; +5V 16.51,31.75; A0 16.51,11.43; A1 16.51,13.97; A2 16.51,16.51; A3 16.51,19.05; A4 16.51,21.59; A5 16.51,24.13; A6 16.51,26.67; A7 16.51,29.21; AREF 16.51,8.89; D0/RX 1.27,36.83; D1/TX 1.27,39.37; D2 1.27,29.21; D3 1.27,26.67; D4 1.27,24.13; D5 1.27,21.59; D6 1.27,19.05; D7 1.27,16.51; D8 1.27,13.97; D9 1.27,11.43; D10 1.27,8.89; D11 1.27,6.35; D12 1.27,3.81; D13 16.51,3.81; GND(1) 1.27,31.75; GND(2) 16.51,36.83; RST(1) 1.27,34.29; RST(2) 16.51,34.29; VIN 16.51,39.37 | hole 2: 1.27,41.91; 16.51,41.91; 16.51,1.27; 1.27,1.27
SERVO_CONTROLLER = drill 1 pad 1.93 long: 0 6.35,34.29; 1 6.35,31.75; 2 6.35,29.21; 3 6.35,26.67; 4 6.35,24.13; 5 6.35,21.59; 6 6.35,16.51; 7 6.35,13.97; 8 6.35,11.43; 9 6.35,8.89; 10 6.35,6.35; 11 6.35,3.81; +5V(OUT) 6.35,19.05; ERR 26.67,15.24; GND 26.67,27.94; RST' 26.67,17.78; RX 26.67,22.86; TX 26.67,20.32; TXIN 26.67,12.7; VIN 26.67,25.4; VSRV 6.35,1.27

### Placement (x,y rotation side)
330Ω  83.82,39.88 270 top
7805_ESC  105.89,41.31 90 top
7805_NUC  34.29,84.01 270 top
7806_NUC  94.14,12.26 90 top
BATTERY_MONITERING  113.19,124.65 270 top
BOOST_24V_NUC  17.62,52.42 270 top
BUCK_7V_ESC  121.92,26.7 90 top
BUCK_7V_NUC  14.13,97.82 270 top
BUCK_12_NUC  22.86,19.08 0 top
C1  99.85,10.19 90 top
C2  99.69,15.11 270 top
C3  27.78,86.39 270 top
C4  27.94,81.47 90 top
C5  104.3,39.72 90 top
C6  104.3,44.48 270 top
D1  82.75,20.81 90 top
D6  89.85,21.15 90 bottom
D7  80.33,30.83 270 top
D8  73.5,30.19 270 top
DEPTH_SENSOR  34.77,105.6 0 top
ESC_5V_JUMPER  107.31,78.61 0 top
ESC_5V_LED  112.87,55.12 180 top
ESC_EMITTER_LED  82.39,122.27 90 top
ESC_PMOS  MOSFET-PCHANNELFQP27P06  [TO220V']  107.79,25.43 90 top
FRC  114.3,63.85 90 top
IR_RECIEVER  72.71,119.89 90 top
ISOLATION_CIRCUIT  81.12,74.33 270 top
J1  9.52,124.02 90 top
JP1  134.46,93.22 270 top
JP2  111.92,93.38 90 top
L298_JUMPER_1  67.15,81.31 90 top
L298_JUMPER_2  72.07,81.31 90 top
L298_MOTOR_DRIVER  74.93,34.32 90 top
LOAD_CONNECTORS  66.36,14.8 0 top
LOAD_NMOS_JUMPER  54.29,81.15 180 bottom
LOAD_POWER_PINS  66.52,11.3 180 top
NANO_5V_JUMPER  38.73,93.85 270 top
NANO_NUC_LED  39.21,127.51 90 top
NUC_5V_JUMPER  108.11,12.89 90 top
NUC_5V_LED  28.89,92.42 180 top
NUC_12V_JUMPER  86.84,11.62 0 top
NUC_GND  86.84,8.13 0 top
NUC_GND1  104.62,12.73 270 bottom
NUC_NANO-CONNECTORS_2  66.2,107.82 270 top
NUC_NANO_CONNECTORS_1  43.18,107.82 90 bottom
NUC_PMOS  MOSFET-PCHANNELFQP27P06  [TO220V']  30.64,122.75 90 top
PMOS_OPTOCOUPLER  105.89,33.21 270 top
Q3  99.06,38.29 0 top
Q4  84.46,27.65 90 top
Q5  90.96,27.02 90 top
Q6  44.77,26.38 90 top
Q7  74.77,27.18 90 top
Q9  67.94,27.02 90 top
Q10  50.19,26.63 90 top
Q11  56.04,26.7 90 top
Q12  62.07,27.02 90 top
R1  33.97,124.17 90 bottom
R2  32.54,116.4 0 top
R3  26.03,100.52 270 top
R5  62.23,54.32 0 top
R6  46.2,130.68 180 top
R7  33.02,96.71 90 top
R9  103.19,119.57 180 top
R10  103.35,117.67 180 top
R11  103.5,123.7 180 top
R12  103.35,121.79 180 top
R13  103.5,127.51 180 top
R14  103.5,125.6 180 top
R15  103.5,131.64 180 top
R16  103.35,129.41 180 top
R17  123.83,115.92 0 top
R18  123.83,117.82 0 top
R19  123.83,119.89 0 top
R20  123.83,121.95 0 top
R21  123.83,124.02 0 top
R22  123.83,126.08 0 top
R23  123.83,128.14 0 top
R24  123.98,130.21 0 top
R26  62.23,58.93 0 top
R27  62.23,61.31 0 top
R29  110.49,25.27 270 top
R30  85.72,39.88 270 top
R31  93.82,40.35 0 top
R32  120.97,52.26 0 bottom
R33  104.46,111 180 top
R34  62.23,56.71 180 bottom
R35  39.53,59.25 180 top
R36  39.37,61.47 180 top
R37  39.37,63.53 0 bottom
R38  39.37,65.75 180 top
R39  109.38,50.83 180 top
REED_SWITCH  32.86,112.59 180 top
SCHOTKKY_DIODE  38.89,84.33 270 top
SERVO_JUMPER  78.9,99.89 90 top
TEMP_SENSOR_1  124.46,66.23 0 top
TEMP_SENSOR_2  124.46,59.5 0 top
TEMP_SENSOR_3  124.49,56.13 0 top
TEMP_SENSOR_4  124.49,62.87 0 top
THRUSTER_ENABLE_JUMPER  93.5,47.82 0 top
THRUSTER_ENABLE_LED  93.19,36.7 0 top
THRUSTER_ENABLE_OPTOCOUPLER  93.5,43.69 270 top
U$1  63.82,129.41 180 top
U$4  81.28,80.68 0 top
U$6  132.08,114.81 180 top

### Tracks (layer width: path | path; a pad name or v marks a point on that pad's centre or on a via)
5V_DIODE
  Bottom 0.813: NANO_5V_JUMPER.2 38.73,90.2 38.89,90.04 SCHOTKKY_DIODE.C
DEPTH_SCL
  Bottom 0.813: 43.02,105.44 NUC_NANO_CONNECTORS_1.7 | NUC_NANO_CONNECTORS_1.7 U$1.A5 | DEPTH_SENSOR.3 36.04,103.7 36.83,102.9 39.53,102.9 41.59,104.97 42.86,104.97 NUC_NANO_CONNECTORS_1.7
DEPTH_SDA
  Bottom 0.813: DEPTH_SENSOR.4 38.58,106.71 39.69,107.82 NUC_NANO_CONNECTORS_1.8 U$1.A4
DIFFUSED_1  (via drill 0.8 pad 1.78)
  Top 0.813: v47.47,19.88 47.47,20.03 45.41,22.09 45.41,34.47 38.58,41.31 38.58,50.51 v38.58,50.83
  Bottom 0.813: 45.4,77.82 LOAD_NMOS_JUMPER.2 45.4,76.23 47.15,74.48 47.15,73.69 44.77,71.31 42.7,71.31 41.75,70.36 40.8,70.36 37.78,67.34 37.78,63.37 41.75,59.4 43.18,59.4 R35.1 43.34,58.77 43.34,58.61 38.73,54.01 38.73,50.2 38.58,50.36 v38.58,50.83 | v47.47,19.88 47.78,20.19 47.78,23.37 Q6.G
DIFFUSED_2  (via drill 0.8 pad 1.78)
  Top 0.813: 41.75,43.05 42.15,42.66 | 42.15,42.66 50.32,34.48 50.32,22.41 v52.86,19.88 | v40.96,50.83 40.96,43.85 42.15,42.66
  Bottom 0.813: LOAD_NMOS_JUMPER.4 47.94,76.07 48.9,75.12 48.9,73.22 45.72,70.04 43.34,70.04 42.23,68.93 41.27,68.93 39.21,66.87 39.21,64.01 41.75,61.47 R36.1 44.29,61.47 45.24,60.51 45.56,60.2 45.56,58.29 44.45,57.18 40.96,53.69 v40.96,50.83 | Q10.G 53.21,23.61 53.21,21.81 53.18,21.78 53.18,20.19 v52.86,19.88
DIFFUSED_LIGHT_1_NANO
  Bottom 0.813: LOAD_NMOS_JUMPER.1 45.4,84.65 46.67,85.92 48.42,85.92 52.55,90.04 52.55,110.36 57.15,114.97 57.15,117.19 60.48,120.52 U$1.D10 NUC_NANO-CONNECTORS_2.3
DIFFUSED_LIGHT_2_NANO
  Bottom 0.813: LOAD_NMOS_JUMPER.3 47.94,83.69 54.13,89.88 54.13,110.2 58.58,114.65 58.58,116.4 60.17,117.98 U$1.D9 NUC_NANO-CONNECTORS_2.4
DL1
  Bottom 1.27: Q6.D 48.74,26.38 49.85,25.27 49.85,19.4 54.29,14.95 57.31,14.95 LOAD_CONNECTORS.1
DL2
  Bottom 1.27: Q10.D 54.05,26.63 55.24,25.43 55.24,21.62 60.01,16.86 LOAD_CONNECTORS.2
DP1
  Bottom 1.27: LOAD_CONNECTORS.7 72.71,15.75 74.77,17.81 77.95,17.81 82.71,22.57 82.71,25.85 D1.A 84.52,27.65 Q4.D
DP2
  Bottom 1.27: Q5.D 90.65,27.02 D6.A 89.85,21.62 87.95,19.72 82.55,19.72 77.79,14.95 76.36,14.95 76.2,14.79 LOAD_CONNECTORS.8
DROPPER_1  (via drill 0.8 pad 1.78, 0.85 pad 1.78)
  Top 0.813: v86.36,21.94 85.41,21.94 84.61,22.73 84.61,29.08 82.23,31.46 73.18,31.46 60.17,44.48 60.17,45.75 v56.99,48.93
  Bottom 0.813: LOAD_NMOS_JUMPER.14 60.64,76.55 58.26,74.17 58.26,67.34 62.39,63.21 62.39,58.61 60.48,56.71 R34.1 57.31,56.71 55.24,54.64 55.24,50.67 v56.99,48.93 | Q4.G 87.31,24.8 86.36,23.84 v86.36,21.94
DROPPER_1_NANO
  Bottom 0.813: U$1.D4 NUC_NANO-CONNECTORS_2.9 68.26,105.28 70.64,102.9 70.64,89.25 68.58,87.19 63.18,87.19 60.8,84.8 60.8,83.85 60.64,83.69 LOAD_NMOS_JUMPER.13 60.64,84.49
DROPPER_2  (via drill 0.8 pad 1.78)
  Top 0.813: v59.21,50.67 61.91,47.97 62.71,47.97 68.74,41.94 68.74,39.56 70.01,38.29 73.98,38.29 79.3,32.97 87.71,32.97 91.44,29.24 91.44,22.57 v92.87,21.15
  Bottom 0.813: LOAD_NMOS_JUMPER.16 63.18,76.55 60.01,73.37 60.01,67.82 63.82,64.01 63.82,57.34 60.8,54.32 R5.1 57.63,54.32 56.99,53.69 56.99,51.62 57.94,50.67 v59.21,50.67 | Q5.G 93.5,21.78 v92.87,21.15
DROPPER_2_NANO  (via drill 0.8 pad 1.78)
  Top 0.813: v53.18,115.28 53.66,114.81 53.66,95.12 63.34,85.44 v64.61,85.44
  Bottom 0.813: v53.18,115.28 48.26,110.36 U$1.A3 NUC_NANO_CONNECTORS_1.9 | LOAD_NMOS_JUMPER.15 63.18,84.33 64.29,85.44 v64.61,85.44
ESC_1_SIGNAL
  Bottom 0.813: ISOLATION_CIRCUIT.18 101.44,55.3 103.95,57.82 109.3,57.82 110.25,58.77 FRC.2
ESC_2_SIGNAL
  Bottom 0.813: ISOLATION_CIRCUIT.17 98.9,54.9 103.09,59.09 108.74,59.09 110.81,61.15 112.87,61.15 FRC.4
ESC_3_SIGNAL
  Bottom 0.813: FRC.6 111.44,63.85 108.04,60.44 102.48,60.44 98.58,56.55 97.47,56.55 96.76,55.83 96.36,55.43 ISOLATION_CIRCUIT.16
ESC_4_SIGNAL
  Bottom 0.813: FRC.8 112.87,66.55 112.08,66.55 107.31,61.79 101.76,61.79 97.79,57.82 93.66,57.82 91.44,55.59 91.44,54.17 ISOLATION_CIRCUIT.14
ESC_5_SIGNAL
  Bottom 0.813: ISOLATION_CIRCUIT.13 88.74,55.12 92.71,59.09 97.16,59.09 101.12,63.06 106.84,63.06 109.86,66.07 109.86,67.18 111.6,68.93
  Bottom 1.27: FRC.10 111.6,68.93
ESC_5V
  Bottom 0.813: R31.2 95.57,40.35 93.19,42.73 93.19,44.96 | ESC_5V_JUMPER.2 108.43,78.45 108.43,72.74 | 108.43,72.74 108.43,69.25 107.31,68.14 107.31,67.5 105.46,65.64 99.43,65.64 95.73,61.94 90.65,61.94 85.57,56.86 82.39,56.86 81.28,55.75 81.28,52.9 83.19,50.99 89.22,50.99 92.31,47.89 THRUSTER_ENABLE_JUMPER.1 92.23,46.39 93.19,45.43 93.19,44.96 | 108.43,72.74 116.53,72.74 121.92,67.34 TEMP_SENSOR_1.1 | 93.19,44.96 93.34,44.96 93.82,44.48 96.84,44.48 THRUSTER_ENABLE_OPTOCOUPLER.4 97.31,46.54 98.43,47.66 102.39,47.66 C6.1
  Bottom 1.27: TEMP_SENSOR_3.1 121.95,59.47 TEMP_SENSOR_2.1 121.92,62.84 TEMP_SENSOR_4.1 121.95,66.2 TEMP_SENSOR_1.1 | 109.06,50.83 109.06,49.56 105.25,45.75 C6.1 106.84,45.75 108.43,44.16 7805_ESC.3 | 109.06,50.83 109.06,51.47 ISOLATION_CIRCUIT.20 106.68,53.85 | R39.2 109.06,50.83
ESC_6_SIGNAL
  Bottom 0.813: ISOLATION_CIRCUIT.12 86.2,55.12 91.44,60.36 96.36,60.36 100.3,64.29 106.17,64.29 108.59,66.71 108.59,67.66 110.01,69.09 110.01,69.88 111.12,70.99 114.14,70.99 115.57,69.56 FRC.9
ESC_7V
  Bottom 1.27: BUCK_7V_ESC.OUT+ 113.28,40.93 111.12,38.77 7805_ESC.1 108.11,38.45 C5.1
ESC_BATTERY_MAIN
  Bottom 0.813: FRC.5 117.59,63.85 118.6,62.84 118.6,54 121.92,50.67
  Bottom 1.016: 121.92,50.67 121.92,38.93 112.08,29.08 R29.1 108.9,29.08 ESC_PMOS.3
ESC_CELL_1
  Bottom 1.016: BATTERY_MONITERING.2 117.16,129.73 117.63,130.21 R24.1
ESC_CELL_1_NANO
  Bottom 0.813: R24.2 127.79,130.37 127.64,130.37 | 128.11,128.14 R23.2 127.64,130.37 | 127.64,130.37 126.37,130.37 124.14,128.14 124.14,116.87 118.59,111.32 118.59,104.49 117.47,103.38 U$6.A0 115.41,103.54 JP2.12
ESC_CELL_2
  Bottom 1.016: BATTERY_MONITERING.4 114.62,127.35 116.05,127.35 116.84,127.35 118.11,126.08 R22.1
ESC_CELL_2_NANO
  Bottom 0.813: 128.59,124.02 R21.2 R22.2 126.52,126.08 125.57,125.13 125.57,116.4 120.17,111 120.17,103.38 117.63,100.84 U$6.A1 115.41,101 JP2.11
ESC_CELL_3
  Bottom 1.016: R20.1 119.22,121.95 116.52,124.65 BATTERY_MONITERING.6
ESC_CELL_3_NANO
  Bottom 0.813: R20.2 R19.2 128.75,119.89 130.02,118.62 130.02,115.12 127.79,112.9 126.37,112.9 123.35,109.89 123.35,100.84 118.27,95.76 U$6.A3 112.08,95.76 JP2.9
ESC_CELL_4
  Bottom 0.813: BATTERY_MONITERING.8 116.52,122.11 117.79,120.84 117.79,119.09 118.9,117.98 120.02,117.98
  Bottom 1.016: BATTERY_MONITERING.8 115.89,122.11 | 120.02,117.98 R18.1
ESC_CELL_4_NANO
  Bottom 0.813: R18.2 R17.2 | 117.63,98.3 116.21,98.3 | 116.21,98.3 U$6.A2 | R17.2 127.48,115.76 | 116.21,98.3 118.11,98.3 121.76,101.95 121.76,110.36 127.32,115.92 R17.2 | JP2.10 116.05,98.46 116.21,98.3
ESC_GND
  Bottom 0.813: ISOLATION_CIRCUIT.19 103.98,55.59 104.93,56.55 107.31,56.55 108.74,55.12 ESC_5V_LED.K 110.97,54.48 110.97,42.1 110.33,41.47 108.27,41.47 7805_ESC.2 | 122.08,129.41 122.56,128.94 122.56,125.76 120.81,124.02 R21.1 122.56,124.02 122.56,121.63 120.81,119.89 R19.1 122.56,119.89 122.56,117.51 120.97,115.92 R17.1 118.59,114.49 117.95,114.49 | R23.1 120.81,128.14 122.08,129.41 | R33.1 108.74,111.47 108.74,111.32 108.59,111.16 108.59,112.74 110.33,114.49 117.95,114.49 | U$6.GND(2) 116.05,77.98 | TEMP_SENSOR_1.2 124.46,69.56 118.27,75.76 118.27,77.34 117.63,77.98 U$6.GND(2) | 131.44,7.78 BUCK_7V_ESC.IN- 117.82,6.89 114.3,3.37 112.08,3.37 110.81,4.64 110.81,18.13 108.27,20.67 105.57,20.67 102.71,23.53 102.71,28.61 105.73,31.62 105.73,35.91 106.04,36.23 | PMOS_OPTOCOUPLER.3 111.44,31.94 113.03,33.53 113.03,35.27 112.08,36.23 106.04,36.23 | 131.44,46.51 BUCK_7V_ESC.OUT- | BUCK_7V_ESC.OUT- 130.52,46.51 | FRC.7 117.63,66.39 120,64.03 120,54.4 122.13,52.26 R32.1 | 122.08,129.41 124.78,132.11 129.06,132.11 130.49,130.68 130.49,122.27 136.84,115.92 136.84,63.53 129.22,55.91 129.22,51.47 130.56,50.13 BUCK_7V_ESC.OUT- | 130.52,46.51 129.98,46.51 | 130.52,46.51 R32.1 | BATTERY_MONITERING.10 117.16,116.87 117.16,115.28 117.95,114.49 | JP2.2 112.08,77.98 U$6.GND(2) | R32.1 124.49,52.55 124.49,55.72 | C6.2 102.55,43.21 101.76,42.42 101.76,37.18 Q3.E 101.92,37.02 102.71,36.23 106.04,36.23
  Bottom 1.27: TEMP_SENSOR_1.2 124.46,62.9 TEMP_SENSOR_4.2 124.65,62.71 124.65,58.96 124.62,58.93 124.46,59.09 TEMP_SENSOR_2.2 124.62,59.34 124.62,55.59 124.49,55.72 TEMP_SENSOR_3.2 | C6.2 104.3,41.47 | 104.3,41.47 108.27,41.47 | 104.3,41.47 C5.2
  Bottom 2.54: BUCK_7V_ESC.IN- BUCK_7V_ESC.OUT-
  pour Bottom (isolate 0.813): 120.33,1.14 120.33,136.87 139.7,136.87 139.7,-0.76 139.38,-0.76 120.33,-0.76
ESC_PMOS
  Bottom 0.813: R29.2 109.06,22.89 ESC_PMOS.1 105.57,22.89 104.3,24.16 104.3,28.45 107,31.15 107,33.21 108.27,34.48 PMOS_OPTOCOUPLER.4
ESC_POWER
  Bottom 1.016: ESC_PMOS.2 112.4,25.43 112.71,25.11 112.71,7.46 BUCK_7V_ESC.IN+
FL1
  Bottom 1.27: Q11.D 60.01,26.7 61.6,25.11 61.6,19.56 62.55,18.61 LOAD_CONNECTORS.3 62.71,14.64
FL2
  Bottom 1.27: Q12.D 66.2,27.02 67.15,26.07 67.15,20.03 65.09,17.97 LOAD_CONNECTORS.4
FOCUSSED_1  (via drill 0.8 pad 1.78)
  Top 0.813: v59.21,20.99 59.05,20.99 55.59,24.45 55.59,35.56 47.36,43.79 43.34,47.82 43.34,48.77 v43.34,51.15
  Bottom 0.813: R37.1 41.75,63.53 40.48,64.8 40.48,66.07 41.91,67.5 42.7,67.5 43.66,68.45 46.2,68.45 50.48,72.74 50.48,76.55 LOAD_NMOS_JUMPER.6 | R37.1 43.5,63.21 | R37.1 44.45,63.53 46.99,60.99 46.99,57.18 43.34,53.53 v43.34,51.15 | v59.21,20.99 58.9,21.3 58.9,23.84 Q11.G
FOCUSSED_2  (via drill 0.8 pad 1.78)
  Top 0.813: v64.61,20.99 64.69,21.07 64.69,21.7 61.6,24.8 61.6,32.26 46.2,47.66 v46.2,51.94
  Bottom 0.813: 42.31,65.68 42.39,65.75 R38.1 | R38.1 44.77,65.75 48.42,62.1 48.42,56.07 46.04,53.69 46.04,51.78 v46.2,51.94 | v64.61,20.99 64.93,21.3 64.93,24.16 Q12.G | R38.1 43.18,65.91 44.29,67.02 46.83,67.02 52.39,72.58 52.39,79.25 LOAD_NMOS_JUMPER.8
FOCUSSED_LIGHT_1_NANO
  Bottom 0.813: LOAD_NMOS_JUMPER.5 50.48,84.17 55.4,89.09 55.4,109.41 61.44,115.44 U$1.D8 NUC_NANO-CONNECTORS_2.5
FOCUSSED_LIGHT_2_NANO
  Bottom 0.813: NUC_NANO-CONNECTORS_2.6 U$1.D7 61.12,112.9 56.83,108.62 56.83,88.45 53.02,84.65 LOAD_NMOS_JUMPER.7 53.02,83.53
GRABBER_1_CONTROL_1_NANO  (via drill 0.8 pad 1.78)
  Top 0.813: v68.9,90.68 68.9,88.93 68.9,88.14 69.69,87.34 69.69,77.5 v68.42,76.23
  Bottom 0.813: 67.47,100.2 NUC_NANO-CONNECTORS_2.11 | U$1.D2 67.47,100.2 | 67.47,100.2 67.63,100.04 67.63,99.89 68.9,98.62 v68.9,90.68 | L298_JUMPER_1.2 68.58,81.31 69.69,80.2 69.69,77.5 v68.42,76.23
GRABBER_1_CONTROL_2_NANO  (via drill 0.8 pad 1.78)
  Top 0.813: v72.39,98.46 69.06,101.79 v68.74,101.79
  Bottom 0.813: v68.74,101.79 67.79,102.74 NUC_NANO-CONNECTORS_2.10 U$1.D3 | v72.39,98.46 72.39,88.45 69.53,85.6 69.53,82.74 70.96,81.31 L298_JUMPER_2.2
IN1
  Bottom 0.813: L298_MOTOR_DRIVER.IN1 71.91,60.99 71.75,60.83 71.28,60.83 64.77,67.34 64.77,82.74 65.88,83.85 L298_JUMPER_1.3
  Bottom 1.27: L298_MOTOR_DRIVER.IN1 L298_MOTOR_DRIVER.IN1H
IN2
  Bottom 0.813: L298_MOTOR_DRIVER.IN2H 78.9,63.53 80.49,65.12 80.49,69.41 79.22,70.68 77.31,70.68 77.15,70.83 77.15,77.34 74.45,80.04 74.45,82.74 73.34,83.85 L298_JUMPER_2.3
  Bottom 1.27: L298_MOTOR_DRIVER.IN2 L298_MOTOR_DRIVER.IN2H
IN3
  Bottom 0.813: L298_JUMPER_1.1 66.36,77.98 66.36,69.09 69.53,65.91 72.23,65.91 L298_MOTOR_DRIVER.IN3
  Bottom 1.27: L298_MOTOR_DRIVER.IN3 L298_MOTOR_DRIVER.IN3H
IN4
  Bottom 0.813: L298_JUMPER_2.1 73.82,78.77 75.41,77.18 75.41,69.88 74.14,68.61 L298_MOTOR_DRIVER.IN4
  Bottom 1.27: L298_MOTOR_DRIVER.IN4 L298_MOTOR_DRIVER.IN4H
IR_RECIEVE
  Bottom 0.813: U$1.D11 NUC_NANO-CONNECTORS_2.2 66.36,122.9 71.75,122.9 72.71,123.86 IR_RECIEVER.3
N$1
  Bottom 0.813: NUC_NANO_CONNECTORS_1.1 U$1.VIN
N$2
  Bottom 0.813: NANO_NUC_LED.K 41.12,130.68 R6.2
N$3  (via drill 3.5)
  other vias: 71.91,74.01
N$4
  Bottom 0.813: R31.1 90.01,38.61 THRUSTER_ENABLE_LED.A
N$5
  Bottom 0.813: ESC_5V_LED.A 114.3,54.96 114.3,52.9 113.19,51.78 R39.1
N$6
  Bottom 0.813: SERVO_JUMPER.12 87.47,112.59 U$4.1
  Bottom 1.016: U$4.1 87.47,112.27
N$7
  Bottom 0.813: NUC_NANO_CONNECTORS_1.3 U$1.RST(2)
N$8
  Bottom 0.813: PMOS_OPTOCOUPLER.2 99.69,31.94 97.79,33.85 91.44,33.85 88.74,36.54 88.74,38.45 85.72,41.47 84.61,41.47 83.82,42.26 330Ω.1
N$9
  Bottom 0.813: SERVO_JUMPER.10 87.47,107.51 U$4.3
N$10  (via drill 0.8 pad 1.78)
  Top 0.813: v96.52,112.9 96.84,113.22 119.86,113.22 126.68,106.39 126.68,97.03 v123.51,93.85
  Bottom 0.813: v96.52,112.9 89.06,120.36 83.03,120.36 ESC_EMITTER_LED.A | v123.51,93.85 123.51,91.31 126.68,88.14 U$6.D3 JP1.10
N$11
  Bottom 0.813: SERVO_JUMPER.8 87.47,102.43 U$4.5
N$13
  Bottom 0.813: SERVO_JUMPER.5 87.47,94.81 U$4.7
N$14
  Bottom 0.813: 88.58,42.42 THRUSTER_ENABLE_OPTOCOUPLER.2 89.53,42.58 87.95,42.58 86.84,43.69 R30.1
N$15
  Bottom 0.813: SERVO_JUMPER.3 87.47,89.73 U$4.9
N$16
  Bottom 0.813: THRUSTER_ENABLE_LED.K 96.2,36.7 Q3.C
N$17
  Bottom 0.813: NUC_NANO_CONNECTORS_1.13 U$1.AREF
N$18
  Bottom 0.813: R33.2 100.65,111.47 90.33,121.79 86.36,121.79 84.61,123.54 ESC_EMITTER_LED.K
N$19
  Bottom 0.813: SERVO_JUMPER.1 87.47,84.65 U$4.11
N$20
  Bottom 0.813: U$1.D1/TX NUC_NANO-CONNECTORS_2.15
N$21
  Bottom 0.813: U$1.D0/RX NUC_NANO-CONNECTORS_2.14
N$22
  Bottom 0.813: U$1.RST(1) NUC_NANO-CONNECTORS_2.13
N$23
  Bottom 0.813: NUC_NANO-CONNECTORS_2.12 62.07,97.66 | 61.91,97.82 62.07,97.66 | 62.07,97.66 U$1.GND(1)
N$24  (via drill 3.5)
  other vias: 28.58,132.59
N$25  (via drill 3.5)
  other vias: 134.58,125.59
N$26  (via drill 3.5)
  other vias: 81.44,2.89
N$28  (via drill 3)
  other vias: 34.92,37.5
N$29  (via drill 3)
  other vias: 34.92,74.17
N$30
  Bottom 0.813: JP2.1 112.08,75.44 U$6.VIN
N$31
  Bottom 0.813: JP2.3 112.08,80.52 U$6.RST(2)
N$32
  Bottom 0.813: JP2.13 115.41,106.08 U$6.AREF
N$33
  Bottom 0.813: JP2.14 115.41,108.62 U$6.3V3
N$34
  Bottom 0.813: NUC_PMOS.1 33.81,120.2 R1.1 36.35,117.98 R2.2
N$35
  Bottom 0.813: JP2.15 115.41,111.16 U$6.D13
N$36
  Bottom 0.813: U$6.D1/TX JP1.15
N$37
  Bottom 0.813: U$6.D0/RX JP1.14
N$38
  Bottom 0.813: R3.2 26.19,96.55 26.19,94.49 26.19,93.85 NUC_5V_LED.K
N$39
  Bottom 0.813: U$6.RST(1) JP1.13
N$40
  Bottom 0.813: U$6.GND(1) JP1.12
N$41
  Bottom 0.813: U$6.D2 JP1.11
N$42
  Bottom 0.813: U$6.D4 JP1.9
N$43
  Bottom 0.813: U$6.D5 JP1.8
N$44
  Bottom 0.813: U$6.D6 JP1.7
N$45
  Bottom 0.813: JP1.6 U$6.D7
N$46
  Bottom 0.813: U$6.D8 JP1.5
N$47
  Bottom 0.813: U$6.D9 JP1.4
N$48
  Bottom 0.813: U$6.D10 JP1.3
N$49
  Bottom 0.813: U$6.D11 JP1.2
N$50
  Bottom 0.813: U$6.D12 JP1.1
NANO_5V
  Bottom 0.813: NANO_5V_JUMPER.1 38.5,95.36 38.73,95.6 40.8,97.66 NUC_NANO_CONNECTORS_1.4 | 42.86,97.34 NUC_NANO_CONNECTORS_1.4 | NUC_NANO_CONNECTORS_1.4 U$1.+5V
NANO_ESC_5V
  Bottom 0.813: ESC_5V_JUMPER.1 106.04,80.36 108.74,83.06 111.76,83.06 JP2.4 115.41,83.22 U$6.+5V
NUC_3V3
  Bottom 0.813: U$1.3V3 NUC_NANO_CONNECTORS_1.14 41.27,123.06 40.48,122.27 40.48,111 37.46,107.98 34.61,107.98 33.5,106.87 DEPTH_SENSOR.2
NUC_5V
  Bottom 0.813: 39.05,79.25 SCHOTKKY_DIODE.A | PMOS_OPTOCOUPLER.1 103.35,34.48 104.3,33.53 104.3,31.94 102.55,30.19 101.28,30.19 | NUC_5V_JUMPER.3 NUC_5V_JUMPER.2 108.11,11.14 | 107.79,17.02 NUC_5V_JUMPER.4 | NUC_5V_LED.A 32.54,92.42 R7.1 33.02,91 34.61,89.41 34.61,81.95 35.08,81.47 | 81.91,45.59 81.91,42.26 84.46,39.72 85.57,39.72 87.47,37.81 87.47,35.75 90.81,32.42 96.84,32.42 99.06,30.19 101.28,30.19 | 81.91,45.59 81.91,50.04 79.85,52.1 79.85,56.39 81.91,58.45 85.09,58.45 90.01,63.37 95.09,63.37 98.72,67 105.07,67 105.89,67.82 105.89,68.61 106.52,69.25 ISOLATION_CIRCUIT.1 106.52,72.9 101.76,77.66 101.76,95.6 97.31,100.04 97.31,103.85 93.66,107.51 93.66,110.05 92.39,111.32 92.39,114.17 88.9,117.67 78.42,117.67 76.2,119.89 IR_RECIEVER.2 | 100.97,29.88 101.28,30.19 | 80.8,45.75 81.76,45.75 81.91,45.59
  Bottom 1.27: 31.27,81.47 7805_NUC.3 35.08,81.47 36.67,81.47 SCHOTKKY_DIODE.A | 31.27,81.47 30,80.2 C4.1 | 100.97,29.88 100.97,22.73 104.62,19.08 107.16,19.08 108.11,18.13 NUC_5V_JUMPER.4 NUC_5V_JUMPER.3 108.11,11.14 NUC_5V_JUMPER.1 107.63,8.6 107.63,11.14 NUC_5V_JUMPER.2 | 31.27,81.47 31.27,80.99 30.96,80.68 30.96,49.72 39.37,41.31 64.45,41.31 68.9,45.75 80.8,45.75
NUC_6V
  Bottom 1.016: D1.C 88.58,15.73 89.52,15.73 D6.C 90.01,15.91
  Bottom 1.27: LOAD_POWER_PINS.2 LOAD_POWER_PINS.1 77.37,11.3 81.8,15.73 D1.C | 88.58,15.73 95.74,15.73 7806_NUC.3 98.27,16.38 C2.1
NUC_7V
  Bottom 0.813: 7805_NUC.1 31.62,86.42
  Bottom 1.27: BUCK_7V_NUC.OUT+ 22.77,84.39 26.03,87.66 C3.1 30.64,87.66 7805_NUC.1
NUC_12V
  Bottom 0.813: 68.42,8.6 68.42,8.76 69.37,9.72 | 69.37,9.72 69.53,9.56 69.53,8.6 | 68.42,9.4 67.79,9.4 | 69.37,9.72 69.69,10.03 | 69.69,10.03 69.85,10.03 | 69.69,10.03 69.06,10.03 68.42,9.4 | 68.42,9.4 68.42,10.03 68.26,10.19 | 92.07,10.99 91.76,10.67 89.06,10.67
  Bottom 1.27: D7.C 74.14,35.91 D8.C 73.5,39.24 L298_MOTOR_DRIVER.12VH L298_MOTOR_DRIVER.12V 69.69,43.12 69.69,42.26 63.82,36.39 46.9,36.39 42.67,32.16 BUCK_12_NUC.OUT+ 42.51,27.88 39.81,27.88 35.27,32.42 31.59,32.42 29.37,34.64 29.37,37.5 28.26,38.61 24.92,38.61 22.46,36.15 22.46,30.91 26.51,26.86 32.86,26.86 51.12,8.6 67.79,8.6 | 70.33,8.6 LOAD_POWER_PINS.3 | 67.79,8.6 67.79,9.4 LOAD_POWER_PINS.4 | NUC_12V_JUMPER.1 81.91,11.62 82.39,12.1 | 67.79,8.6 68.42,8.6 69.06,8.6 | 69.06,8.6 69.53,8.6 70.33,8.6 | 69.06,8.6 69.06,8.76 | 82.39,12.1 90.65,12.1 90.81,11.94 88.42,11.94 NUC_12V_JUMPER.3 NUC_12V_JUMPER.4 91.44,11.62 92.07,10.99 | 82.39,12.1 81.6,12.1 78.1,8.6 70.33,8.6
  Bottom 2.54: LOAD_POWER_PINS.4 LOAD_POWER_PINS.3 | NUC_12V_JUMPER.1 NUC_12V_JUMPER.2 NUC_12V_JUMPER.3 | NUC_12V_JUMPER.4 93.25,11.62 95.15,9.72 7806_NUC.1 97.47,8.92 C1.1
NUC_24V
  Bottom 1.27: LOAD_POWER_PINS.5 LOAD_POWER_PINS.6 LOAD_POWER_PINS.7 LOAD_POWER_PINS.8 51.91,11.3 33.78,29.43 29.43,29.43 BOOST_24V_NUC.OUT+
NUC_BATTERY_MAIN
  Bottom 0.813: 30.96,125.6 NUC_PMOS.3
  Bottom 1.27: NUC_PMOS.3 33.34,127.98 R1.2
  Bottom 2.032: 9.05,127.67 11.27,129.89 21.11,129.89 25.4,125.6 30.96,125.6
  Bottom 2.54: 9.05,127.67 9.05,124.49 J1.+
NUC_CELL_1
  Bottom 0.813: R9.1 108.11,119.57 110.65,122.11 BATTERY_MONITERING.7
NUC_CELL_1_NANO
  Bottom 0.813: NUC_NANO_CONNECTORS_1.6 U$1.A6 49.05,102.74 50.16,103.85 50.16,109.89 55.4,115.12 55.4,122.11 61.52,128.22 92.63,128.22 93.82,127.03 93.82,125.76 97.16,122.43 97.16,120.84 98.43,119.57 R9.2 99.38,117.82 R10.2
NUC_CELL_2
  Bottom 0.813: BATTERY_MONITERING.5 110.81,124.65 109.86,123.7 R11.1
NUC_CELL_2_NANO
  Bottom 0.813: NUC_NANO_CONNECTORS_1.10 U$1.A2 48.42,112.9 53.66,118.14 53.66,122.27 61.12,129.73 93.82,129.73 95.73,127.83 95.73,126.56 98.58,123.7 R11.2 99.69,121.95 R12.2
NUC_CELL_3
  Bottom 0.813: R13.1 111.6,127.51 BATTERY_MONITERING.3
NUC_CELL_3_NANO
  Bottom 0.813: NUC_NANO_CONNECTORS_1.11 U$1.A1 48.74,115.44 52.23,118.94 52.23,122.9 60.64,131.32 72.55,131.32 73.34,131.32 94.93,131.32 97.47,128.78 97.47,127.98 99.3,126.16 99.69,126.56 R13.2 | R14.2 R13.2 | R13.2 100.49,127.51
NUC_CELL_4
  Bottom 0.813: R15.1 108.59,131.64 110.49,129.73 BATTERY_MONITERING.1
NUC_CELL_4_NANO
  Bottom 0.813: NUC_NANO_CONNECTORS_1.12 U$1.A0 49.37,117.98 50.8,119.41 50.8,123.7 60.01,132.91 95.88,132.91 99.38,129.41 R16.2 99.54,131.48 R15.2
NUC_GND
  Bottom 0.813: R16.1 106.2,129.41 104.46,127.67 104.46,125.6 | 104.46,125.6 R14.1 | R12.1 107.31,121.79 | BATTERY_MONITERING.9 111.92,118.14 111.44,117.67 R10.1 105.17,115.68 104.78,116.08 104.78,120.84 105.73,121.79 R12.1 | NUC_NANO_CONNECTORS_1.2 U$1.GND(2) | 47.94,92.42 47.78,92.58 U$1.GND(2) | 31.59,84.17 7805_NUC.2 | U$1.GND(2) 49.69,92.58 50.96,91.31 50.96,90.2 48.42,87.66 40.48,87.66 | BATTERY_MONITERING.9 110.01,117.67 110.01,117.51 110.49,117.03 112.08,117.03 | 112.55,117.82 112.87,117.51 112.55,117.51 | 112.55,117.82 112.55,118.94 BATTERY_MONITERING.9 | 112.55,117.51 112.08,117.03 | BATTERY_MONITERING.9 112.08,119.41 112.08,117.03 | 112.55,117.82 112.55,117.51 | R12.1 105.89,121.79 104.46,123.22 104.46,125.6
  Bottom 1.016: 7806_NUC.2 99.06,12.26 99.38,12.57 | 99.38,12.57 99.69,12.89 | 99.38,12.57 99.85,13.05
  Bottom 1.27: C1.2 99.85,13.05 | 99.69,12.89 C2.2
  Bottom 2.54: J1.- 16.45,122.21 11.59,117.35 5.78,117.35 BUCK_7V_NUC.IN-
  pour Bottom (isolate 0.813): -2.38,0.67 -2.38,136.72 112.4,136.72 117.47,136.72 117.47,-0.44 -2.38,-0.44
NUC_NANO_D13
  Bottom 0.813: 48.42,125.6 U$1.D13 NUC_NANO_CONNECTORS_1.15 40.48,125.6 39.85,126.24 NANO_NUC_LED.A
NUC_POWER
  Bottom 1.016: 3.49,27.34 3.11,27.72 BUCK_12_NUC.IN+
  Bottom 1.27: 3.62,27.81 3.52,27.72 BUCK_12_NUC.IN+ | 26.13,72.1 BOOST_24V_NUC.IN+
  Bottom 2.032: BUCK_7V_NUC.IN+ 27.88,122.75 NUC_PMOS.2
  Bottom 2.54: 26.13,72.1 21.91,72.1 20.24,70.44 | 20.24,70.44 15.72,65.91 15.72,32.1 10.86,27.24 3.05,27.24 BUCK_12_NUC.IN+ | 20.24,70.44 16.51,74.17 16.51,113.7 20.45,117.63 BUCK_7V_NUC.IN+
REED_1  (via drill 0.8 pad 1.78)
  Top 0.813: v28.42,110.68 28.42,102.58 29.37,101.63 29.53,101.63 v30.32,100.84
  Bottom 0.813: 42.55,100.2 NUC_NANO_CONNECTORS_1.5 | REED_SWITCH.3 v28.42,110.68 | U$1.A7 47.15,100.36 43.34,100.36 NUC_NANO_CONNECTORS_1.5 | NUC_NANO_CONNECTORS_1.5 42.23,100.2 | NUC_NANO_CONNECTORS_1.5 42.86,100.52 R7.2 30.64,100.52 v30.32,100.84
REED_2
  Bottom 0.813: R2.1 30.8,116.4 32.86,114.33 REED_SWITCH.2
SERVO_1
  Bottom 0.813: SERVO_JUMPER.13 87.47,115.12 U$4.0 | ISOLATION_CIRCUIT.3 101.44,75.28 99.85,76.87 99.85,94.81 95.41,99.25 95.41,103.38 91.92,106.87 91.92,109.41 90.49,110.84 90.49,113.54 89.06,114.97 U$4.0 | U$4.0 88.74,114.97
SERVO_2
  Bottom 0.813: 87.79,110.05 U$4.2 | SERVO_JUMPER.11 87.47,110.05 U$4.2 | U$4.2 89.38,109.89 90.49,108.78 90.49,106.08 93.5,103.06 93.5,98.14 97.95,93.69 97.95,76.55 99.22,75.28 99.22,72.1 ISOLATION_CIRCUIT.4
SERVO_3
  Bottom 0.813: ISOLATION_CIRCUIT.5 95.88,72.26 95.88,93.22 91.6,97.5 91.6,102.43 89.22,104.81 U$4.4 87.31,104.81 79.06,104.81 SERVO_JUMPER.9
SERVO_4
  Bottom 0.813: SERVO_JUMPER.6 87.47,97.34 U$4.6 88.9,97.19 93.98,92.11 93.98,78.14 90.49,74.64 89.53,74.64 88.74,73.85 ISOLATION_CIRCUIT.8
SERVO_5
  Bottom 0.813: SERVO_JUMPER.4 87.47,92.27 U$4.8 89.53,92.11 92.39,89.25 92.39,78.93 89.69,76.23 88.26,76.23 86.2,74.17 ISOLATION_CIRCUIT.9
SERVO_6
  Bottom 0.813: SERVO_JUMPER.2 87.47,87.19 U$4.10 89.69,87.03 90.81,85.92 90.81,79.57 89.06,77.82 87.47,77.82 83.66,74.01 ISOLATION_CIRCUIT.10
TEMP_1
  Bottom 0.813: TEMP_SENSOR_1.3 127,69.09 120.02,76.07 120.02,82.74 117.16,85.6 U$6.A7 112.08,85.6 JP2.5
TEMP_2
  Bottom 0.813: JP2.7 112.08,90.68 U$6.A5 116.84,90.68 123.03,84.49 123.03,76.87 130.49,69.41 130.49,62.04 127.95,59.5 TEMP_SENSOR_2.3
TEMP_3
  Bottom 0.813: JP2.8 112.08,93.22 U$6.A4 116.68,93.22 124.46,85.44 124.46,77.66 131.92,70.2 131.92,60.67 127.38,56.13 TEMP_SENSOR_3.3
TEMP_4
  Bottom 0.813: TEMP_SENSOR_4.3 127.35,62.55 128.08,62.55 128.91,63.37 128.91,69.09 121.44,76.55 121.44,83.53 116.68,88.3 115.89,88.3 115.73,88.3 | 115.73,88.3 U$6.A6 | JP2.6 115.73,88.3
THRUSTER_ENABLE  (via drill 0.8 pad 1.78)
  Top 0.813: v69.37,125.76 69.37,107.51 74.45,102.43 74.45,82.11 81.44,75.12 81.44,51.62 85.88,47.18 v86.04,47.18
  Bottom 0.813: NUC_NANO-CONNECTORS_2.1 69.22,125.6 v69.37,125.76 | THRUSTER_ENABLE_OPTOCOUPLER.1 88.26,44.96 v86.04,47.18
  Bottom 1.27: U$1.D12 NUC_NANO-CONNECTORS_2.1
THRUSTER_ENABLE_ESC  (via drill 0.8 pad 1.78)
  Top 0.813: v100.65,45.75 100.65,47.18 98.43,49.4 v98.43,50.04 | v102.08,50.04 102.55,49.56 119.54,49.56 v119.7,49.4
  Bottom 0.813: Q3.B 99.06,38.61 100.33,39.88 100.33,42.42 | 94.46,50.04 v98.43,50.04 v102.08,50.04 | FRC.1 116.21,58.77 116.52,58.45 116.52,52.9 R32.2 119.7,49.72 v119.7,49.4 | 100.33,42.42 100.33,45.43 v100.65,45.75 | THRUSTER_ENABLE_OPTOCOUPLER.3 100.33,42.42 | 94.46,50.04 94.77,49.72 THRUSTER_ENABLE_JUMPER.2 | 94.46,50.04 93.82,50.67 ISOLATION_CIRCUIT.15
TORPEDO_1  (via drill 0.8 pad 1.78)
  Top 0.813: v69.69,21.62 68.42,21.62 66.99,23.05 66.99,31.94 54.45,44.48 51.75,47.18 v51.75,48.29
  Bottom 0.813: v51.75,48.29 51.75,56.55 56.51,61.31 R27.1 58.42,61.94 54.77,65.59 54.77,77.66 55.56,78.45 LOAD_NMOS_JUMPER.10 | Q9.G 70.64,24.32 70.64,22.41 69.85,21.62 v69.69,21.62
TORPEDO_1_NANO
  Bottom 0.813: NUC_NANO-CONNECTORS_2.7 U$1.D6 60.64,110.36 58.26,107.98 58.26,87.66 55.56,84.96 LOAD_NMOS_JUMPER.9
TORPEDO_2  (via drill 0.8 pad 1.78)
  Top 0.813: v54.77,47.97 54.53,47.74 70.64,31.62 71.44,31.62 75.25,27.81 75.25,22.41 v75.88,21.78
  Bottom 0.813: LOAD_NMOS_JUMPER.12 58.1,76.55 56.51,74.96 56.51,66.55 59.69,63.37 60.64,62.42 60.64,59.72 59.85,58.93 R26.1 56.51,58.93 53.5,55.91 53.5,49.4 54.77,48.13 v54.77,47.97 | Q7.G 77.47,24.48 77.47,23.37 v75.88,21.78
TORPEDO_2_NANO
  Bottom 0.813: NUC_NANO-CONNECTORS_2.8 U$1.D5 62.39,107.98 60.8,107.98 59.69,106.87 59.69,86.71 57.94,84.96 57.94,82.58 LOAD_NMOS_JUMPER.11
TP1
  Bottom 1.27: Q9.D 73.34,27.02 73.34,24.96 | 73.34,24.96 D8.A | 73.34,24.96 73.34,22.1 67.63,16.38 LOAD_CONNECTORS.5
TP2
  Bottom 1.27: Q7.D 79.06,27.18 80.33,25.91 D7.A 80.49,25.59 80.49,22.89 77.31,19.72 73.82,19.72 70.17,16.06 LOAD_CONNECTORS.6
(copper drawn outside any net)
  shapes: Top area x5